# EAGLE design EL00117 (EAGLE 7.6.0)

## Sheet 1 of 3
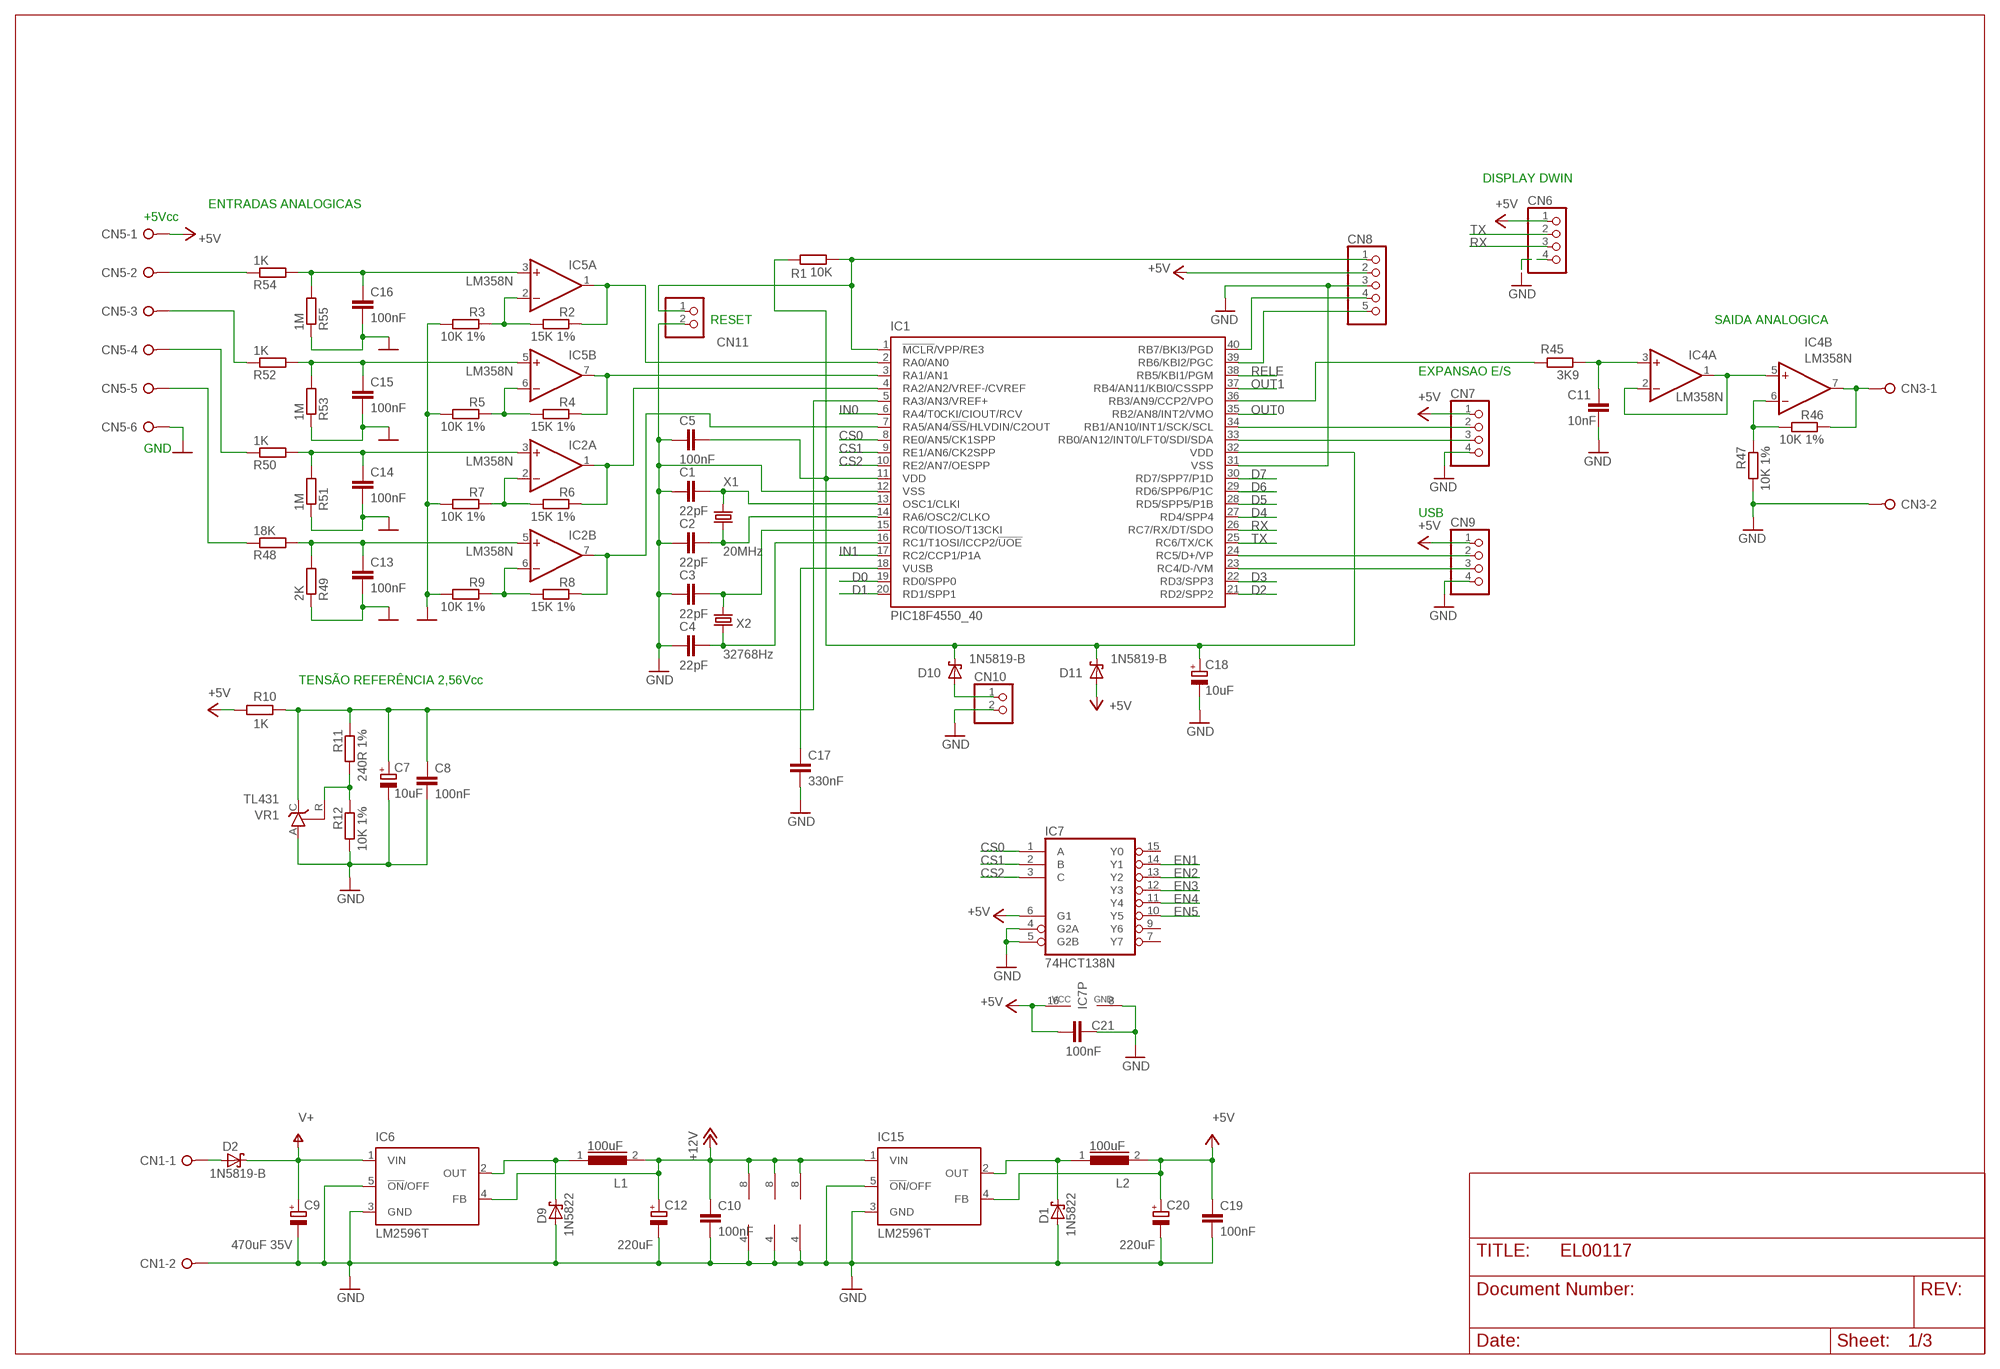
[diagram p0: schematic, sheet 1]

### Parts
C1  22pF  C-EU050-024X044  [C050-024X044]
C2  22pF  C-EU050-024X044  [C050-024X044]
C3  22pF  C-EU050-024X044  [C050-024X044]
C4  22pF  C-EU050-024X044  [C050-024X044]
C5  100nF  C-EU050-024X044  [C050-024X044]
C7  10uF  CPOL-EUE2.5-6  [E2,5-6]
C8  100nF  C-EU050-024X044  [C050-024X044]
C9  470uF 35V  CPOL-EUE3.5-10  [E3,5-10]
C10  100nF  C-EU050-024X044  [C050-024X044]
C11  10nF  C-EU050-024X044  [C050-024X044]
C12  220uF  CPOL-EUE2.5-5  [E2,5-5]
C13  100nF  C-EU050-024X044  [C050-024X044]
C14  100nF  C-EU050-024X044  [C050-024X044]
C15  100nF  C-EU050-024X044  [C050-024X044]
C16  100nF  C-EU050-024X044  [C050-024X044]
C17  330nF  C-EU050-024X044  [C050-024X044]
C18  10uF  CPOL-EUE2.5-6  [E2,5-6]
C19  100nF  C-EU050-024X044  [C050-024X044]
C20  220uF  CPOL-EUE2.5-5  [E2,5-5]
C21  100nF  C-EU050-024X044  [C050-024X044]
CN1  W237-02P  [W237-132]
CN3  W237-02P  [W237-132]
CN5  W237-06P  [W237-6P]
CN6  PINHD-1X4  [1X04]
CN7  PINHD-1X4  [1X04]
CN8  PINHD-1X5  [1X05]
CN9  PINHD-1X4  [1X04]
CN10  PINHD-1X2  [1X02]
CN11  PINHD-1X2  [1X02]
D1  1N5822  1N5819-B  [DO41-7.6]
D2  1N5819-B  [DO41-7.6]
D9  1N5822  1N5819-B  [DO41-7.6]
D10  1N5819-B  [DO41-7.6]
D11  1N5819-B  [DO41-7.6]
IC1  PIC18F4550_40  [DIL40]
IC2  LM358N  [DIL08]
IC4  LM358N  [DIL08]
IC5  LM358N  [DIL08]
IC6  LM2596T  [T05D]
IC7  74HCT138N  [DIL16]
IC15  LM2596T  [T05D]
L1  100uF  82114R  [82114R]
L2  100uF  82114R  [82114R]
R1  10K  R-EU_0309/V  [0309V]
R2  15K 1%  R-EU_0309/V  [0309V]
R3  10K 1%  R-EU_0309/V  [0309V]
R4  15K 1%  R-EU_0309/V  [0309V]
R5  10K 1%  R-EU_0309/V  [0309V]
R6  15K 1%  R-EU_0309/V  [0309V]
R7  10K 1%  R-EU_0309/V  [0309V]
R8  15K 1%  R-EU_0309/V  [0309V]
R9  10K 1%  R-EU_0309/V  [0309V]
R10  1K  R-EU_0309/V  [0309V]
R11  240R 1%  R-EU_0309/V  [0309V]
R12  10K 1%  R-EU_0309/V  [0309V]
R45  3K9  R-EU_0309/V  [0309V]
R46  10K 1%  R-EU_0309/V  [0309V]
R47  10K 1%  R-EU_0309/V  [0309V]
R48  18K  R-EU_0309/V  [0309V]
R49  2K  R-EU_0309/V  [0309V]
R50  1K  R-EU_0309/V  [0309V]
R51  1M  R-EU_0309/V  [0309V]
R52  1K  R-EU_0309/V  [0309V]
R53  1M  R-EU_0309/V  [0309V]
R54  1K  R-EU_0309/V  [0309V]
R55  1M  R-EU_0309/V  [0309V]
VR1  TL431  TL431CLP  [TO92-CLP]
X1  20MHz  CRYSTALHC49U-V  [HC49U-V]
X2  32768Hz  CRYSTALTC26V  [TC26V]

### Nets
+5V: C19.2 C20.+ C21.2 CN5.1 CN6.1 CN7.1 CN8.2 CN9.1 D11.A IC7.6(G1) IC7.16(VCC) IC15.4(FB) L2.2 R10.2 ; also sheet 2,3
+12V: C10.2 C12.+ IC2.8(P:V+) IC4.8(P:V+) IC5.8(P:V+) IC6.4(FB) IC15.1(VIN) L1.2 ; also sheet 2,3
CS0: IC1.8(RE0/AN5/CK1SPP) IC7.1(A)
CS1: IC1.9(RE1/AN6/CK2SPP) IC7.2(B)
CS2: IC1.10(RE2/AN7/OESPP) IC7.3(C)
D0: IC1.19(RD0/SPP0) ; also sheet 2,3
D1: IC1.20(RD1/SPP1) ; also sheet 2,3
D2: IC1.21(RD2/SPP2) ; also sheet 2,3
D3: IC1.22(RD3/SPP3) ; also sheet 2,3
D4: IC1.27(RD4/SPP4) ; also sheet 2,3
D5: IC1.28(RD5/SPP5/P1B) ; also sheet 2,3
D6: IC1.29(RD6/SPP6/P1C) ; also sheet 2,3
D7: IC1.30(RD7/SPP7/P1D) ; also sheet 2,3
EN1: IC7.14(Y1) ; also sheet 2
EN2: IC7.13(Y2) ; also sheet 2
EN3: IC7.12(Y3) ; also sheet 3
EN4: IC7.11(Y4) ; also sheet 3
EN5: IC7.10(Y5) ; also sheet 3
GND: C1.1 C2.1 C3.1 C4.1 C5.1 C7.- C8.1 C9.- C10.1 C11.1 C12.- C13.1 C14.1 C15.1 C16.1 C17.1 C18.- C19.1 C20.- C21.1 CN1.2 CN3.2 CN5.6 CN6.4 CN7.4 CN8.3 CN9.4 CN10.2 CN11.2 D1.A D9.A IC1.12(VSS) IC1.31(VSS) IC2.4(P:V-) IC4.4(P:V-) IC5.4(P:V-) IC6.3(GND) IC6.5(!ON!/OFF) IC7.4(G2A) IC7.5(G2B) IC7.8(GND) IC15.3(GND) IC15.5(!ON!/OFF) R3.2 R5.2 R7.2 R9.2 R12.2 R47.2 R49.1 R51.1 R53.1 R55.1 VR1.A ; also sheet 2,3
IN0: IC1.6(RA4/T0CKI/CIOUT/RCV) ; also sheet 2
IN1: IC1.17(RC2/CCP1/P1A) ; also sheet 2
N$1: C1.2 IC1.13(OSC1/CLKI) X1.2
N$2: C2.2 IC1.14(RA6/OSC2/CLKO) X1.1
N$4: C3.2 IC1.15(RC0/TIOSO/T13CKI) X2.2
N$5: C4.2 IC1.16(RC1/T1OSI/ICCP2/!UOE) X2.1
N$7: CN8.1 CN11.1 IC1.1(!MCLR!/VPP/RE3) R1.1
N$8: IC5.2(A:-IN) R2.2 R3.1
N$9: IC1.2(RA0/AN0) IC5.1(A:OUT) R2.1
N$10: IC1.3(RA1/AN1) IC5.7(B:OUT) R4.1
N$11: IC5.6(B:-IN) R4.2 R5.1
N$12: CN5.2 R54.1
N$13: IC2.2(A:-IN) R6.2 R7.1
N$14: IC2.6(B:-IN) R8.2 R9.1
N$15: IC1.7(RA5/AN4/!SS!/HLVDIN/C2OUT) IC2.7(B:OUT) R8.1
N$16: CN5.3 R52.1
N$17: CN5.4 R50.1
N$18: CN5.5 R48.1
N$21: C7.+ C8.2 IC1.5(RA3/AN3/VREF+) R10.1 R11.1 VR1.C
N$22: R11.2 R12.1 VR1.R
N$23: IC1.4(RA2/AN2/VREF-/CVREF) IC2.1(A:OUT) R6.1
N$25: CN1.1 D2.A
N$28: C13.2 IC2.5(B:+IN) R48.2 R49.2
N$29: C15.2 IC5.5(B:+IN) R52.2 R53.2
N$66: CN7.2 IC1.34(RB1/AN10/INT1/SCK/SCL)
N$68: CN7.3 IC1.33(RB0/AN12/INT0/LFT0/SDI/SDA)
N$69: IC4.1(A:OUT) IC4.2(A:-IN) IC4.5(B:+IN)
N$71: C11.2 IC4.3(A:+IN) R45.1
N$72: IC1.36(RB3/AN9/CCP2/VPO) R45.2
N$73: IC4.6(B:-IN) R46.2 R47.1
N$74: CN3.1 IC4.7(B:OUT) R46.1
N$75: CN9.2 IC1.24(RC5/D+/VP)
N$77: CN9.3 IC1.23(RC4/D-/VM)
N$79: C5.2 C18.+ D10.C D11.C IC1.11(VDD) IC1.32(VDD) R1.2
N$80: C17.2 IC1.18(VUSB)
N$84: CN8.4 IC1.40(RB7/BKI3/PGD)
N$86: CN8.5 IC1.39(RB6/KBI2/PGC)
N$89: CN10.1 D10.A
N$90: D9.C IC6.2(OUT) L1.1
N$137: C16.2 IC5.3(A:+IN) R54.2 R55.2
N$138: C14.2 IC2.3(A:+IN) R50.2 R51.2
N$153: D1.C IC15.2(OUT) L2.1
OUT0: IC1.35(RB2/AN8/INT2/VMO) ; also sheet 2
OUT1: IC1.37(RB4/AN11/KBI0/CSSPP) ; also sheet 2
RELE: IC1.38(RB5/KBI1/PGM) ; also sheet 3
RX: CN6.3 IC1.26(RC7/RX/DT/SDO)
TX: CN6.2 IC1.25(RC6/TX/CK)
V+: C9.+ D2.C IC6.1(VIN)
Unconnected: IC7.7(Y7) IC7.9(Y6) IC7.15(Y0)

### Notes on the sheet
- DISPLAY DWIN
- ENTRADAS ANALOGICAS
- +5Vcc
- RESET | SAIDA ANALOGICA
- EXPANSAO E/S
- GND
- USB
- TENSÃO REFERÊNCIA 2,56Vcc

## Sheet 2 of 3
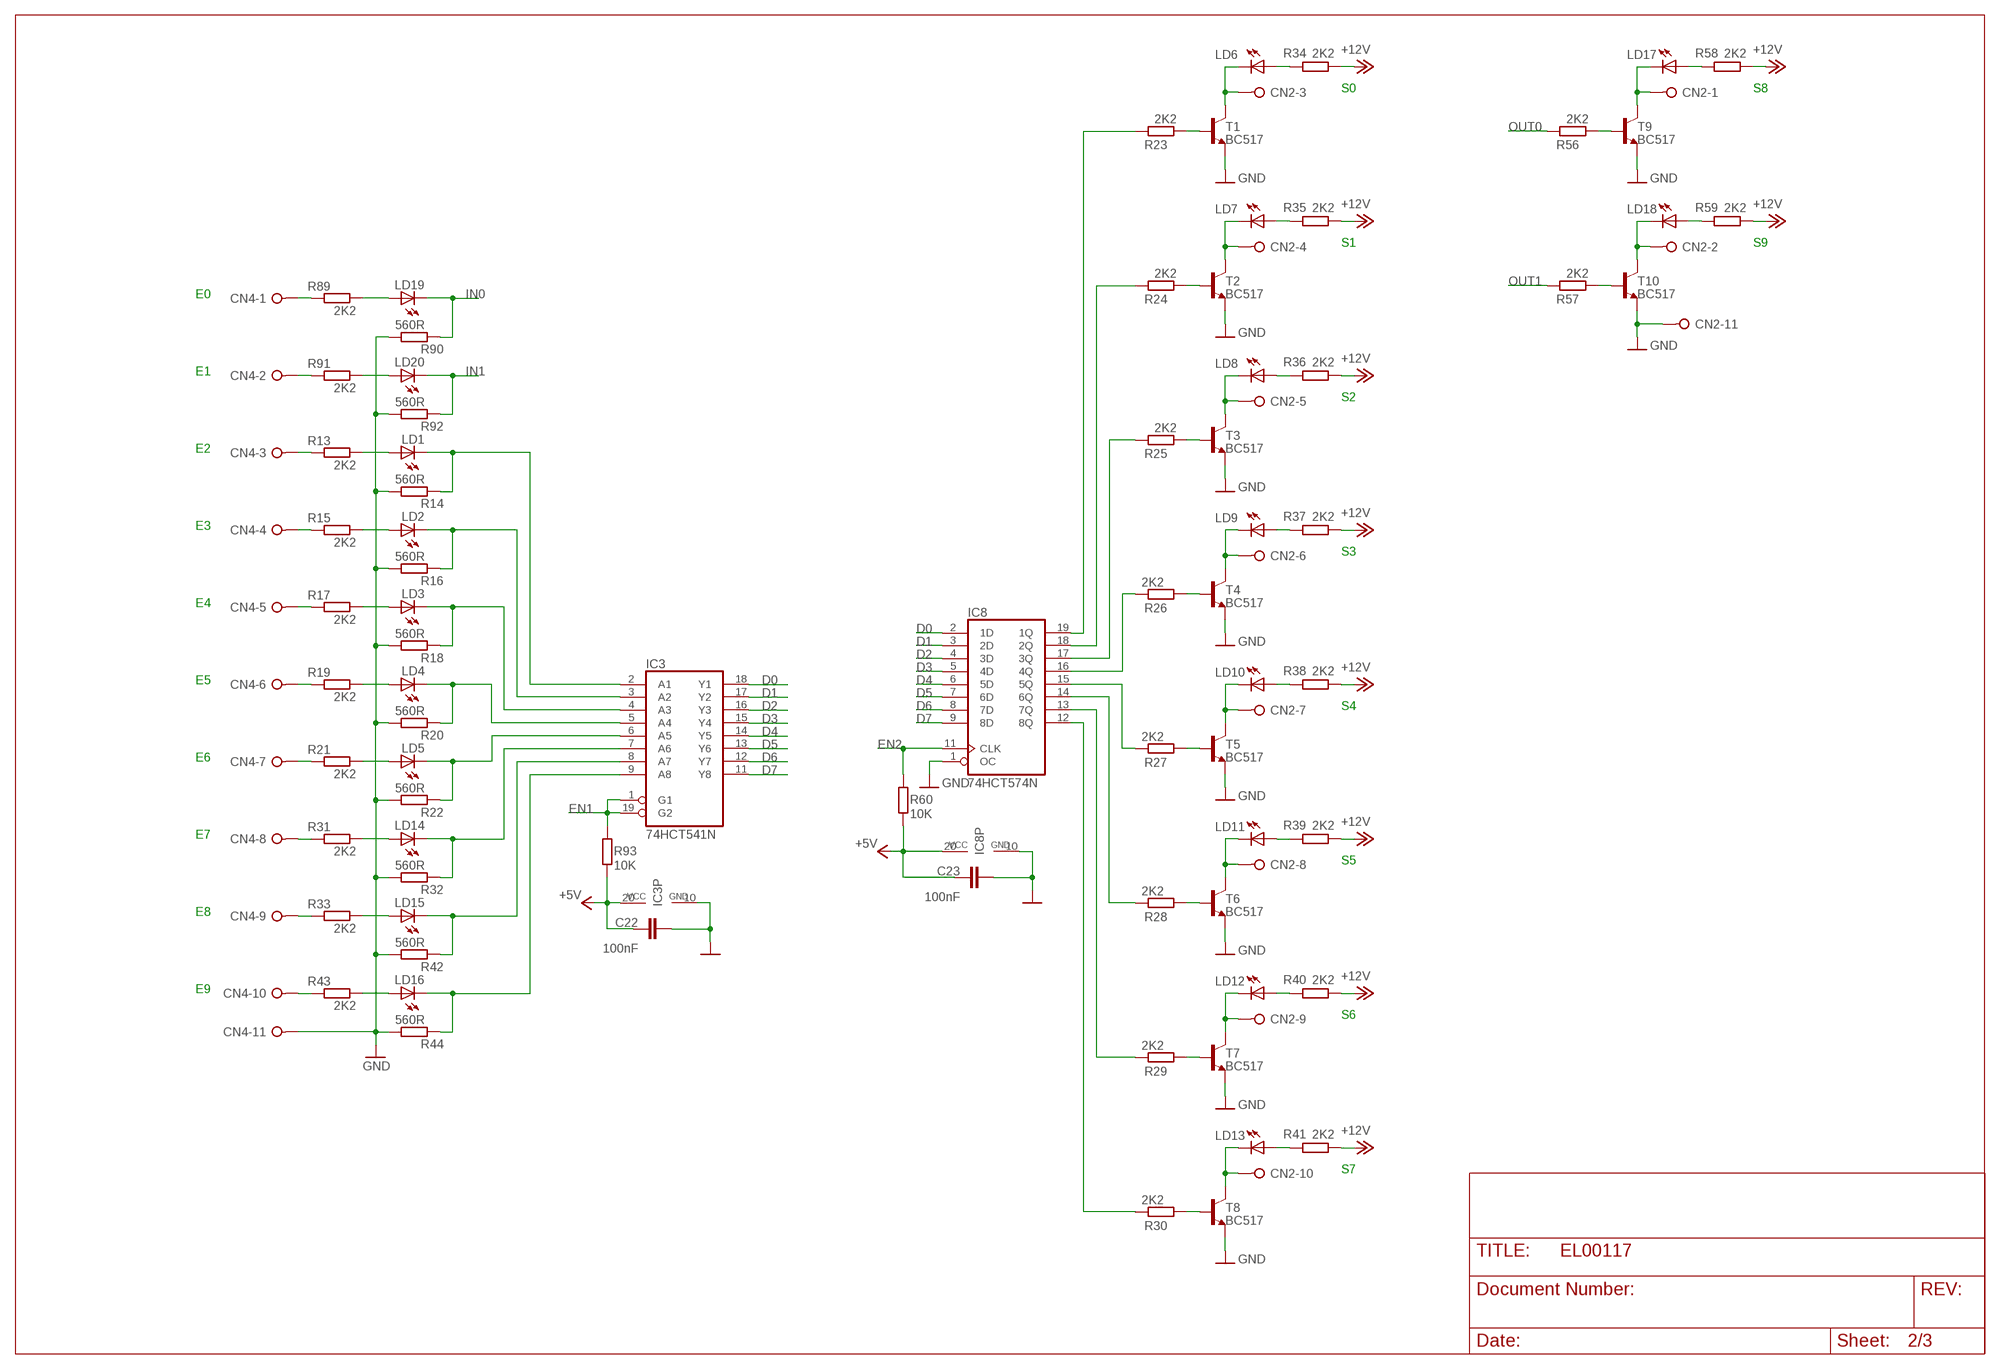
[diagram p1: schematic, sheet 2]

### Parts
C22  100nF  C-EU050-024X044  [C050-024X044]
C23  100nF  C-EU050-024X044  [C050-024X044]
CN2  W237-11P  [W237-11P]
CN4  W237-11P  [W237-11P]
IC3  74HCT541N  [DIL20]
IC8  74HCT574N  [DIL20]
LD1  LED3MM  [LED3MM]
LD2  LED3MM  [LED3MM]
LD3  LED3MM  [LED3MM]
LD4  LED3MM  [LED3MM]
LD5  LED3MM  [LED3MM]
LD6  LED3MM  [LED3MM]
LD7  LED3MM  [LED3MM]
LD8  LED3MM  [LED3MM]
LD9  LED3MM  [LED3MM]
LD10  LED3MM  [LED3MM]
LD11  LED3MM  [LED3MM]
LD12  LED3MM  [LED3MM]
LD13  LED3MM  [LED3MM]
LD14  LED3MM  [LED3MM]
LD15  LED3MM  [LED3MM]
LD16  LED3MM  [LED3MM]
LD17  LED3MM  [LED3MM]
LD18  LED3MM  [LED3MM]
LD19  LED3MM  [LED3MM]
LD20  LED3MM  [LED3MM]
R13  2K2  R-EU_0309/V  [0309V]
R14  560R  R-EU_0309/V  [0309V]
R15  2K2  R-EU_0309/V  [0309V]
R16  560R  R-EU_0309/V  [0309V]
R17  2K2  R-EU_0309/V  [0309V]
R18  560R  R-EU_0309/V  [0309V]
R19  2K2  R-EU_0309/V  [0309V]
R20  560R  R-EU_0309/V  [0309V]
R21  2K2  R-EU_0309/V  [0309V]
R22  560R  R-EU_0309/V  [0309V]
R23  2K2  R-EU_0309/V  [0309V]
R24  2K2  R-EU_0309/V  [0309V]
R25  2K2  R-EU_0309/V  [0309V]
R26  2K2  R-EU_0309/V  [0309V]
R27  2K2  R-EU_0309/V  [0309V]
R28  2K2  R-EU_0309/V  [0309V]
R29  2K2  R-EU_0309/V  [0309V]
R30  2K2  R-EU_0309/V  [0309V]
R31  2K2  R-EU_0309/V  [0309V]
R32  560R  R-EU_0309/V  [0309V]
R33  2K2  R-EU_0309/V  [0309V]
R34  2K2  R-EU_0309/V  [0309V]
R35  2K2  R-EU_0309/V  [0309V]
R36  2K2  R-EU_0309/V  [0309V]
R37  2K2  R-EU_0309/V  [0309V]
R38  2K2  R-EU_0309/V  [0309V]
R39  2K2  R-EU_0309/V  [0309V]
R40  2K2  R-EU_0309/V  [0309V]
R41  2K2  R-EU_0309/V  [0309V]
R42  560R  R-EU_0309/V  [0309V]
R43  2K2  R-EU_0309/V  [0309V]
R44  560R  R-EU_0309/V  [0309V]
R56  2K2  R-EU_0309/V  [0309V]
R57  2K2  R-EU_0309/V  [0309V]
R58  2K2  R-EU_0309/V  [0309V]
R59  2K2  R-EU_0309/V  [0309V]
R60  10K  R-EU_0309/V  [0309V]
R89  2K2  R-EU_0309/V  [0309V]
R90  560R  R-EU_0309/V  [0309V]
R91  2K2  R-EU_0309/V  [0309V]
R92  560R  R-EU_0309/V  [0309V]
R93  10K  R-EU_0309/V  [0309V]
T1  BC517  BC517-NPN-TO92-CBE  [TO92-CBE]
T2  BC517  BC517-NPN-TO92-CBE  [TO92-CBE]
T3  BC517  BC517-NPN-TO92-CBE  [TO92-CBE]
T4  BC517  BC517-NPN-TO92-CBE  [TO92-CBE]
T5  BC517  BC517-NPN-TO92-CBE  [TO92-CBE]
T6  BC517  BC517-NPN-TO92-CBE  [TO92-CBE]
T7  BC517  BC517-NPN-TO92-CBE  [TO92-CBE]
T8  BC517  BC517-NPN-TO92-CBE  [TO92-CBE]
T9  BC517  BC517-NPN-TO92-CBE  [TO92-CBE]
T10  BC517  BC517-NPN-TO92-CBE  [TO92-CBE]

### Nets
+5V: C22.1 C23.1 IC3.20(VCC) IC8.20(VCC) R60.2 R93.2 ; also sheet 1,3
+12V: R34.1 R35.1 R36.1 R37.1 R38.1 R39.1 R40.1 R41.1 R58.1 R59.1 ; also sheet 1,3
D0: IC3.18(Y1) IC8.2(1D) ; also sheet 1,3
D1: IC3.17(Y2) IC8.3(2D) ; also sheet 1,3
D2: IC3.16(Y3) IC8.4(3D) ; also sheet 1,3
D3: IC3.15(Y4) IC8.5(4D) ; also sheet 1,3
D4: IC3.14(Y5) IC8.6(5D) ; also sheet 1,3
D5: IC3.13(Y6) IC8.7(6D) ; also sheet 1,3
D6: IC3.12(Y7) IC8.8(7D) ; also sheet 1,3
D7: IC3.11(Y8) IC8.9(8D) ; also sheet 1,3
ED0: IC3.2(A1) LD1.K(C) R14.2
ED1: IC3.3(A2) LD2.K(C) R16.2
ED2: IC3.4(A3) LD3.K(C) R18.2
ED3: IC3.5(A4) LD4.K(C) R20.2
ED4: IC3.6(A5) LD5.K(C) R22.2
ED5: IC3.7(A6) LD14.K(C) R32.2
ED6: IC3.8(A7) LD15.K(C) R42.2
ED7: IC3.9(A8) LD16.K(C) R44.2
EN1: IC3.1(G1) IC3.19(G2) R93.1 ; also sheet 1
EN2: IC8.11(CLK) R60.1 ; also sheet 1
GND: C22.2 C23.2 CN2.11 CN4.11 IC3.10(GND) IC8.1(OC) IC8.10(GND) R14.1 R16.1 R18.1 R20.1 R22.1 R32.1 R42.1 R44.1 R90.1 R92.1 T1.E T2.E T3.E T4.E T5.E T6.E T7.E T8.E T9.E T10.E ; also sheet 1,3
IN0: LD19.K(C) R90.2 ; also sheet 1
IN1: LD20.K(C) R92.2 ; also sheet 1
N$3: R56.2 T9.B
N$6: R57.2 T10.B
N$20: R29.2 T7.B
N$24: LD1.A R13.1
N$27: R30.2 T8.B
N$30: CN2.1 LD17.K(C) T9.C
N$31: LD2.A R15.1
N$32: R23.2 T1.B
N$33: LD3.A R17.1
N$34: R24.2 T2.B
N$35: LD4.A R19.1
N$36: LD5.A R21.1
N$37: R25.2 T3.B
N$38: CN4.1 R89.2
N$39: R26.2 T4.B
N$40: R27.2 T5.B
N$41: R28.2 T6.B
N$42: CN4.2 R91.2
N$43: CN4.3 R13.2
N$44: CN4.4 R15.2
N$45: CN4.5 R17.2
N$46: CN2.3 LD6.K(C) T1.C
N$47: CN2.4 LD7.K(C) T2.C
N$48: LD6.A R34.2
N$49: LD7.A R35.2
N$50: CN2.5 LD8.K(C) T3.C
N$51: LD8.A R36.2
N$52: CN2.6 LD9.K(C) T4.C
N$53: LD9.A R37.2
N$54: CN2.7 LD10.K(C) T5.C
N$55: CN2.8 LD11.K(C) T6.C
N$56: LD10.A R38.2
N$57: LD11.A R39.2
N$58: CN2.9 LD12.K(C) T7.C
N$59: LD12.A R40.2
N$60: CN2.10 LD13.K(C) T8.C
N$61: LD13.A R41.2
N$62: CN2.2 LD18.K(C) T10.C
N$64: LD17.A R58.2
N$65: LD18.A R59.2
N$67: LD14.A R31.1
N$70: CN4.6 R19.2
N$76: CN4.7 R21.2
N$78: CN4.8 R31.2
N$81: LD15.A R33.1
N$82: CN4.9 R33.2
N$83: CN4.10 R43.2
N$85: LD16.A R43.1
N$97: IC8.16(4Q) R26.1
N$98: IC8.15(5Q) R27.1
N$99: IC8.17(3Q) R25.1
N$100: IC8.18(2Q) R24.1
N$101: IC8.19(1Q) R23.1
N$102: IC8.14(6Q) R28.1
N$103: IC8.13(7Q) R29.1
N$104: IC8.12(8Q) R30.1
N$183: LD19.A R89.1
N$184: LD20.A R91.1
OUT0: R56.1 ; also sheet 1
OUT1: R57.1 ; also sheet 1

### Notes on the sheet
- S0 | S8
- S1 | S9
- E0
- E1
- S2
- E2
- E3
- S3
- E4
- E5
- S4
- E6
- E7
- S5
- E8
- E9
- S6
- S7

## Sheet 3 of 3
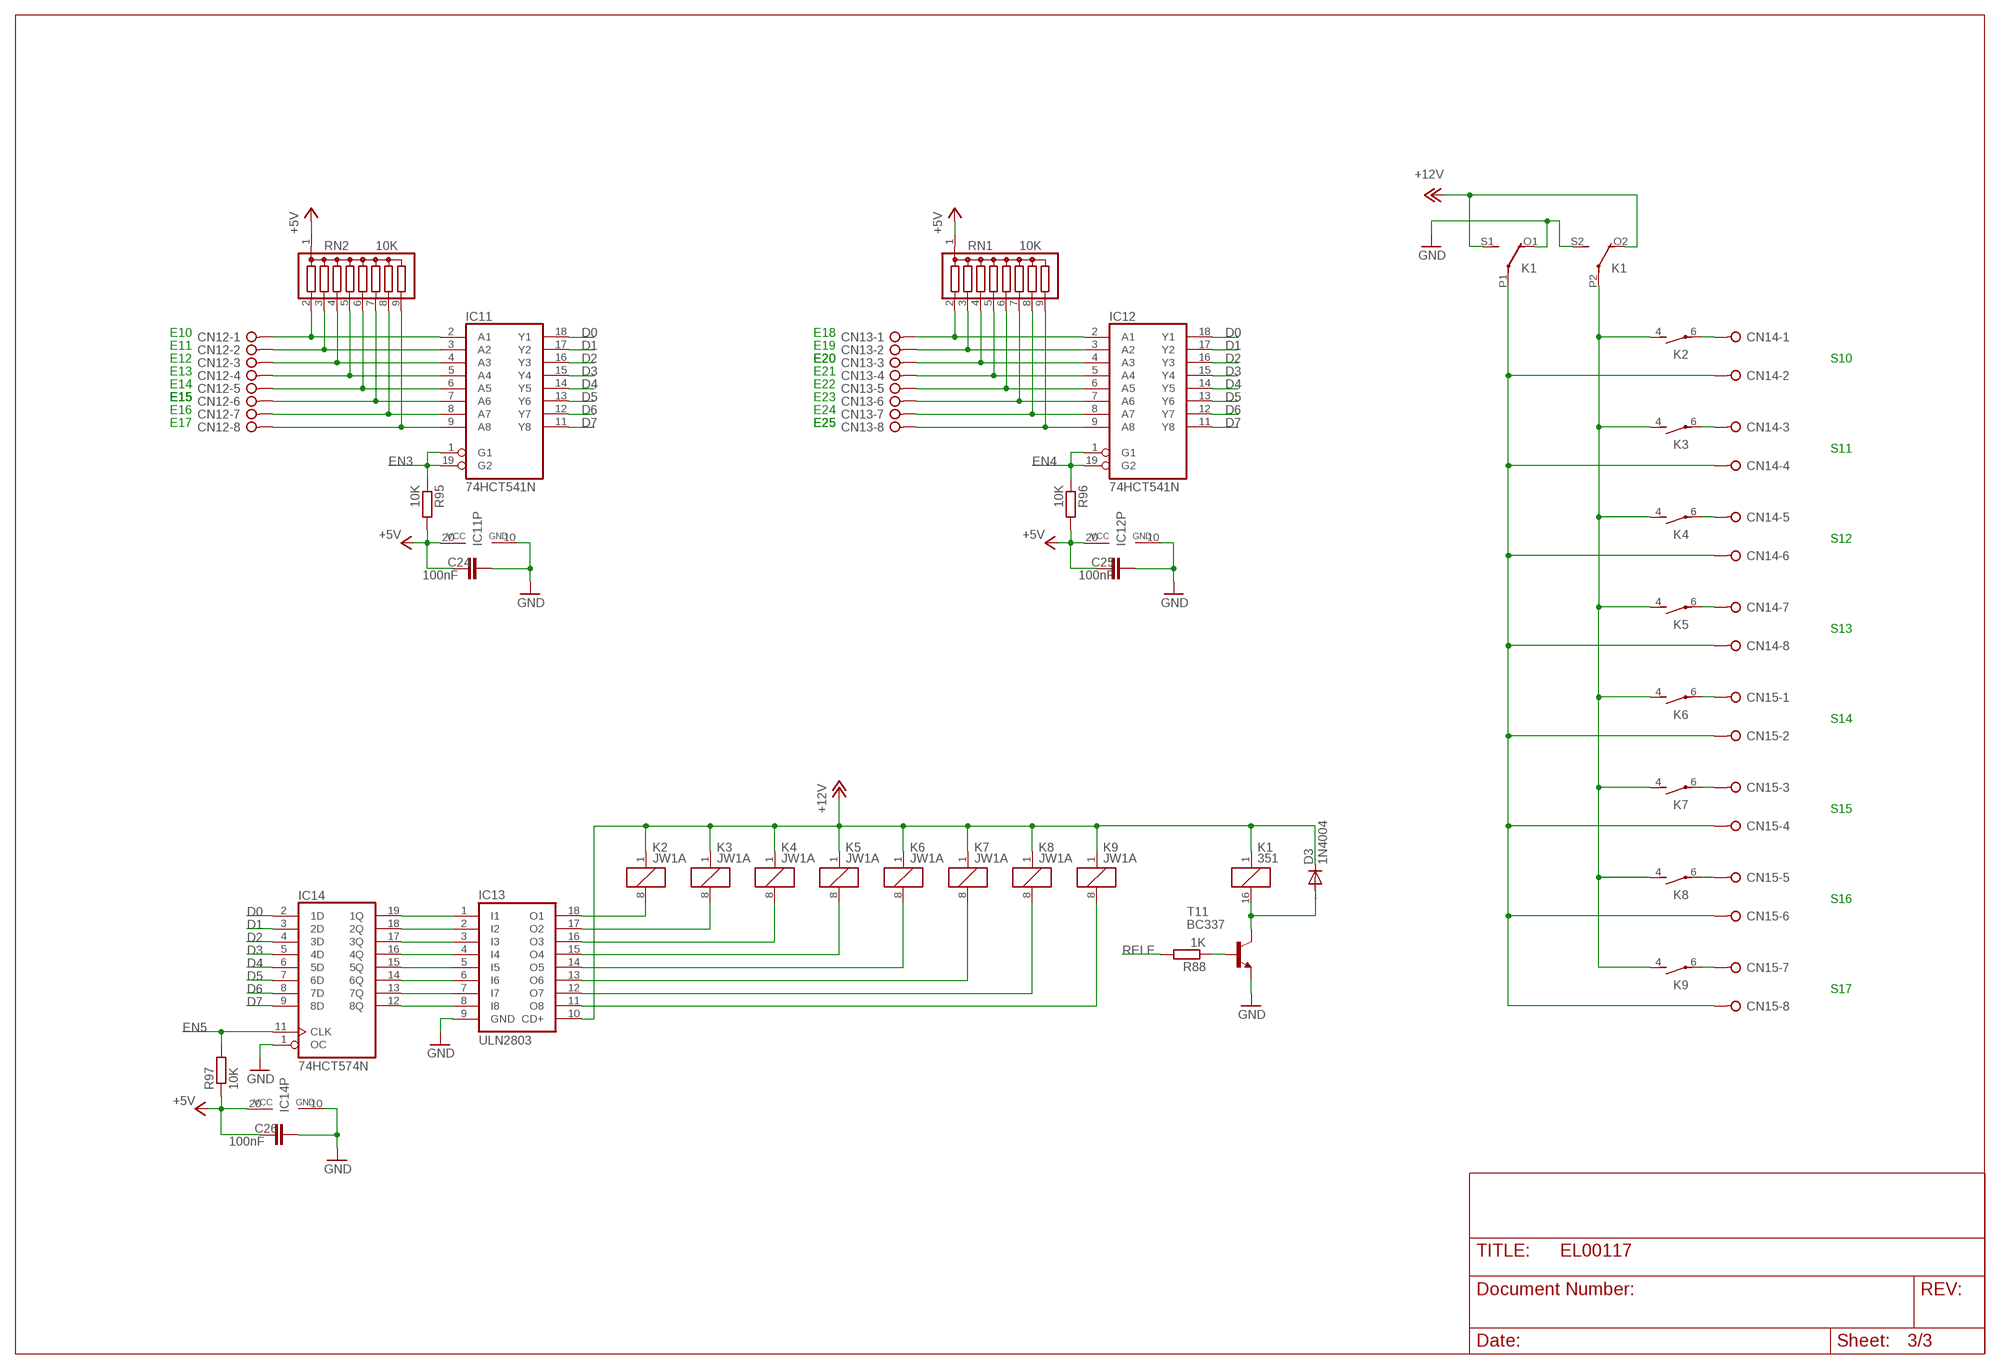
[diagram p2: schematic, sheet 3]

### Parts
C24  100nF  C-EU050-024X044  [C050-024X044]
C25  100nF  C-EU050-024X044  [C050-024X044]
C26  100nF  C-EU050-024X044  [C050-024X044]
CN12  W237-08P  [W237-8P]
CN13  W237-08P  [W237-8P]
CN14  W237-08P  [W237-8P]
CN15  W237-08P  [W237-8P]
D3  1N4004  [DO41-10]
IC11  74HCT541N  [DIL20]
IC12  74HCT541N  [DIL20]
IC13  ULN2803  ULN2803A  [DIL18]
IC14  74HCT574N  [DIL20]
K1  351  [351]
K2  JW1A  [JW1A]
K3  JW1A  [JW1A]
K4  JW1A  [JW1A]
K5  JW1A  [JW1A]
K6  JW1A  [JW1A]
K7  JW1A  [JW1A]
K8  JW1A  [JW1A]
K9  JW1A  [JW1A]
R88  1K  R-EU_0309/V  [0309V]
R95  10K  R-EU_0309/V  [0309V]
R96  10K  R-EU_0309/V  [0309V]
R97  10K  R-EU_0309/V  [0309V]
RN1  10K  G08R  [SIL9]
RN2  10K  G08R  [SIL9]
T11  BC337  [TO92]

### Nets
+5V: C24.1 C25.2 C26.2 IC11.20(VCC) IC12.20(VCC) IC14.20(VCC) R95.2 R96.2 R97.1 RN1.1 RN2.1 ; also sheet 1,2
+12V: D3.C IC13.10(CD+) K1.1 K1.O2(3:O) K1.S1(2:S) K2.1 K3.1 K4.1 K5.1 K6.1 K7.1 K8.1 K9.1 ; also sheet 1,2
D0: IC11.18(Y1) IC12.18(Y1) IC14.2(1D) ; also sheet 1,2
D1: IC11.17(Y2) IC12.17(Y2) IC14.3(2D) ; also sheet 1,2
D2: IC11.16(Y3) IC12.16(Y3) IC14.4(3D) ; also sheet 1,2
D3: IC11.15(Y4) IC12.15(Y4) IC14.5(4D) ; also sheet 1,2
D4: IC11.14(Y5) IC12.14(Y5) IC14.6(5D) ; also sheet 1,2
D5: IC11.13(Y6) IC12.13(Y6) IC14.7(6D) ; also sheet 1,2
D6: IC11.12(Y7) IC12.12(Y7) IC14.8(7D) ; also sheet 1,2
D7: IC11.11(Y8) IC12.11(Y8) IC14.9(8D) ; also sheet 1,2
EN3: IC11.1(G1) IC11.19(G2) R95.1 ; also sheet 1
EN4: IC12.1(G1) IC12.19(G2) R96.1 ; also sheet 1
EN5: IC14.11(CLK) R97.2 ; also sheet 1
GND: C24.2 C25.1 C26.1 IC11.10(GND) IC12.10(GND) IC13.9(GND) IC14.1(OC) IC14.10(GND) K1.O1(2:O) K1.S2(3:S) T11.1(E) ; also sheet 1,2
N$19: CN12.1 IC11.2(A1) RN2.2
N$26: IC13.18(O1) K2.8
N$63: CN12.2 IC11.3(A2) RN2.3
N$139: CN12.3 IC11.4(A3) RN2.4
N$140: CN12.4 IC11.5(A4) RN2.5
N$141: CN12.5 IC11.6(A5) RN2.6
N$142: CN12.6 IC11.7(A6) RN2.7
N$143: CN12.7 IC11.8(A7) RN2.8
N$144: CN12.8 IC11.9(A8) RN2.9
N$145: CN13.1 IC12.2(A1) RN1.2
N$146: CN13.2 IC12.3(A2) RN1.3
N$147: CN13.3 IC12.4(A3) RN1.4
N$148: CN13.4 IC12.5(A4) RN1.5
N$149: CN13.5 IC12.6(A5) RN1.6
N$150: CN13.6 IC12.7(A6) RN1.7
N$151: CN13.7 IC12.8(A7) RN1.8
N$152: CN13.8 IC12.9(A8) RN1.9
N$155: K1.P2(3:P) K2.4(1:S) K3.4(1:S) K4.4(1:S) K5.4(1:S) K6.4(1:S) K7.4(1:S) K8.4(1:S) K9.4(1:S)
N$156: IC13.17(O2) K3.8
N$157: CN14.1 K2.6(1:P)
N$158: CN14.3 K3.6(1:P)
N$159: CN14.5 K4.6(1:P)
N$160: CN14.7 K5.6(1:P)
N$161: CN15.1 K6.6(1:P)
N$162: CN15.3 K7.6(1:P)
N$163: CN15.5 K8.6(1:P)
N$164: CN15.7 K9.6(1:P)
N$165: IC13.16(O3) K4.8
N$166: IC13.15(O4) K5.8
N$167: IC13.14(O5) K6.8
N$168: IC13.13(O6) K7.8
N$169: IC13.12(O7) K8.8
N$170: IC13.11(O8) K9.8
N$171: R88.1 T11.2(B)
N$172: IC13.1(I1) IC14.19(1Q)
N$173: CN14.2 CN14.4 CN14.6 CN14.8 CN15.2 CN15.4 CN15.6 CN15.8 K1.P1(2:P)
N$174: IC13.2(I2) IC14.18(2Q)
N$175: IC13.3(I3) IC14.17(3Q)
N$176: IC13.4(I4) IC14.16(4Q)
N$177: IC13.5(I5) IC14.15(5Q)
N$178: IC13.6(I6) IC14.14(6Q)
N$179: IC13.7(I7) IC14.13(7Q)
N$180: IC13.8(I8) IC14.12(8Q)
N$181: D3.A K1.16 T11.3(C)
RELE: R88.2 ; also sheet 1

### Notes on the sheet
- E10 | E18
- E11 | E19
- E12 | E20 | E20 | S10
- E13 | E21
- E14 | E22
- E15 | E15 | E15 | E23
- E16 | E24
- E17 | E25 | E25
- S11
- S12
- S13
- S14
- S15
- S16
- S17

## Library data of the parts
C1-C5 C8 C10 C11 C13-C17 C19 C21-C26 = rcl:C-EU: CAPACITOR, European symbol
C7 C9 C12 C18 C20 = rcl:CPOL-EU: POLARIZED CAPACITOR, European symbol
CN1 CN3 = con-wago-508:W237-02P: WAGO SREW CLAMP; OC_FARNELL: unknown; OC_NEWARK: unknown
CN2 CN4 = con-wago-508:W237-11P: WAGO SREW CLAMP; OC_FARNELL: unknown; OC_NEWARK: unknown
CN5 = con-wago-508:W237-06P: WAGO SREW CLAMP; OC_FARNELL: unknown; OC_NEWARK: unknown
CN6 CN7 CN9 = pinhead:PINHD-1X4: PIN HEADER
CN8 = pinhead:PINHD-1X5: PIN HEADER
CN10 CN11 = pinhead:PINHD-1X2: PIN HEADER
CN12-CN15 = con-wago-508:W237-08P: WAGO SREW CLAMP; OC_FARNELL: unknown; OC_NEWARK: unknown
D1 D2 D9-D11 = diode:1N581*: 1.0A SCHOTTKY BARRIER RECTIFIER Source: http://www.diodes.com/datasheets/ds23001.pdf
D3 = diode:1N4004: DIODE general purpose rectifier, 1 A
IC1 = microchip:PIC18F4*_40: USB Microcontrollers with nanoWatt Technology High-Performance, Enhanced Flash, 28/40/44-Pin, Source: http://ww1.microchip.com/downloads/en/devicedoc/39632c.pdf; MF: MICROCHIP; MPN: PIC18F4550-I/P; OC_FARNELL: 9321357; OC_NEWARK: 74K8623
IC2 IC4 IC5 = linear:LM358: OP AMP also LM158; LM258; LM2904 Source: http://cache.national.com/ds/LM/LM158.pdf
IC3 IC11 IC12 = 74xx-eu:74*541: Octal BUFFER and LINE DRIVER, 3-state
IC6 IC15 = national-semiconductor:LM2596: SIMPLE SWITCHER® Power Converter 150 kHz 3A Step-Down Voltage Regulator Source: http://www.national.com/ds/LM/LM2596.pdf; MPN: LM2596T-ADJ/LF02; OC_FARNELL: 9494162; OC_NEWARK: 65K5910
IC7 = 74xx-eu:74*138: 3-line to 8-line DECODER/DEMULTIPLEXER
IC8 IC14 = 74xx-eu:74*574: 8-bit D type FLIP FLOP bus driver
IC13 = uln-udn:ULN2803A: DRIVER ARRAY
K1 = relay:351: RELAY 2 x switch, Omron; OC_FARNELL: unknown; OC_NEWARK: unknown
K2-K9 = relay:JW1A: Power relay Source: Panasonic Electric Works Co., Ltd. / jw.catalog.pdf
L1 L2 = inductors:82114R: INDUCTOR
LD1-LD20 = led:LED: LED OSRAM: - CHIPLED LG R971, LG N971, LY N971, LG Q971, LY Q971, LO R971, LY R971 LH N974, LH R974 LS Q976, LO Q976, LY Q976 LO Q996 - Hyper CHIPLED LW Q18S LB Q993, LB Q99A, LB R99A - SideLED LS A670, LO A670, LY A670, LG A670, LP A670 LB A673, LV A673, LT A673, LW A673 LH A674 LY A675 LS A676, LA A676, LO A676, LY A676, LW A676 LS A679, LY A679, LG A679 - Hyper Micro SIDELED® LS Y876, LA Y876, LO Y876, LY Y876 LT Y87S - SmartLED LW L88C, LW L88S LB L89C, LB L89S, LG L890 LS L89K, LO L89K, LY L89K LS L896, LA L896, LO L896, LY L896 - TOPLED LS T670, LO T670, LY T670, LG T670, LP T670 LSG T670, LSP T670, LSY T670, LOP T670, LYG T670 LG T671, LOG T671, LSG T671 LB T673, LV T673, LT T673, LW T673 LH T674 LS T676, LA T676, LO T676, LY T676, LB T676, LH T676, LSB T676, LW T676 LB T67C, LV T67C, LT T67C, LS T67K, LO T67K, LY T67K, LW E67C LS E67B, LA E67B, LO E67B, LY E67B, LB E67C, LV E67C, LT E67C LW T67C LS T679, LY T679, LG T679 LS T770, LO T770, LY T770, LG T770, LP T770 LB T773, LV T773, LT T773, LW T773 LH T774 LS E675, LA E675, LY E675, LS T675 LS T776, LA T776, LO T776, LY T776, LB T776 LHGB T686 LT T68C, LB T68C - Hyper Mini TOPLED® LB M676 - Mini TOPLED Santana® LG M470 LS M47K, LO M47K, LY M47K Source: http://www.osram.convergy.de LUXEON: - LUMILED® LXK2-PW12-R00, LXK2-PW12-S00, LXK2-PW14-U00, LXK2-PW14-V00 LXK2-PM12-R00, LXK2-PM12-S00, LXK2-PM14-U00 LXK2-PE12-Q00, LXK2-PE12-R00, LXK2-PE12-S00, LXK2-PE14-T00, LXK2-PE14-U00 LXK2-PB12-K00, LXK2-PB12-L00, LXK2-PB12-M00, LXK2-PB14-N00, LXK2-PB14-P00, LXK2-PB14-Q00 LXK2-PR12-L00, LXK2-PR12-M00, LXK2-PR14-Q00, LXK2-PR14-R00 LXK2-PD12-Q00, LXK2-PD12-R00, LXK2-PD12-S00 LXK2-PH12-R00, LXK2-PH12-S00 LXK2-PL12-P00, LXK2-PL12-Q00, LXK2-PL12-R00 Source: www.luxeon.com KINGBRIGHT: KA-3528ASYC Source: www.kingbright.com
R1-R60 R88-R93 R95-R97 = rcl:R-EU_: RESISTOR, European symbol
RN1 RN2 = resistor-sil:G08R: SIL RESISTOR; OC_FARNELL: unknown; OC_NEWARK: unknown
T1-T10 = transistor:*-NPN-: NPN Transistror BF959 corrected 2008.03.06
T11 = transistor:BC337: NPN TRANSISTOR
VR1 = v-reg:TL431CLP: VOLTAGE REGULATOR
X1 = crystal:CRYSTAL: CRYSTAL; OC_FARNELL: 1666969; OC_NEWARK: unknown
X2 = crystal:CRYSTAL: CRYSTAL; OC_FARNELL: unknown; OC_NEWARK: unknown

## Board
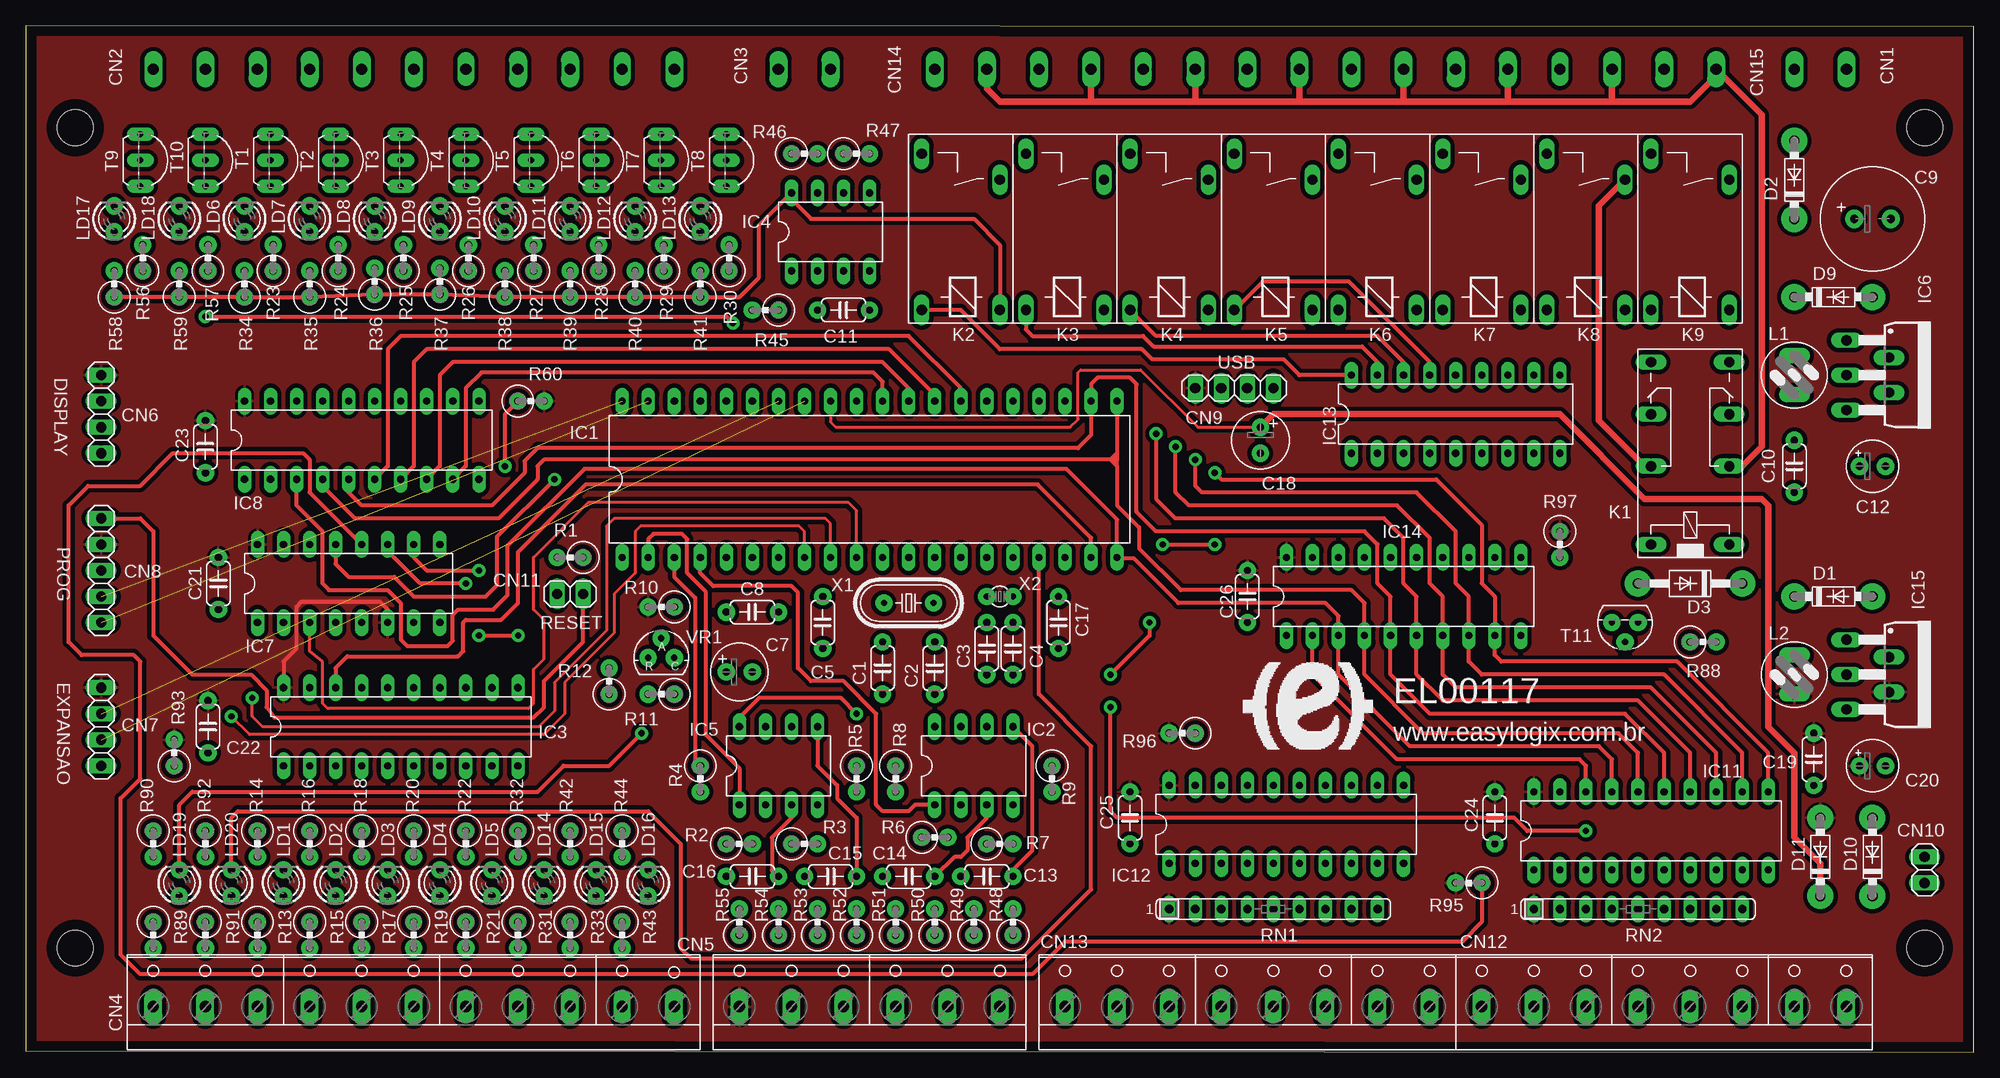
[diagram p3: board, top side]
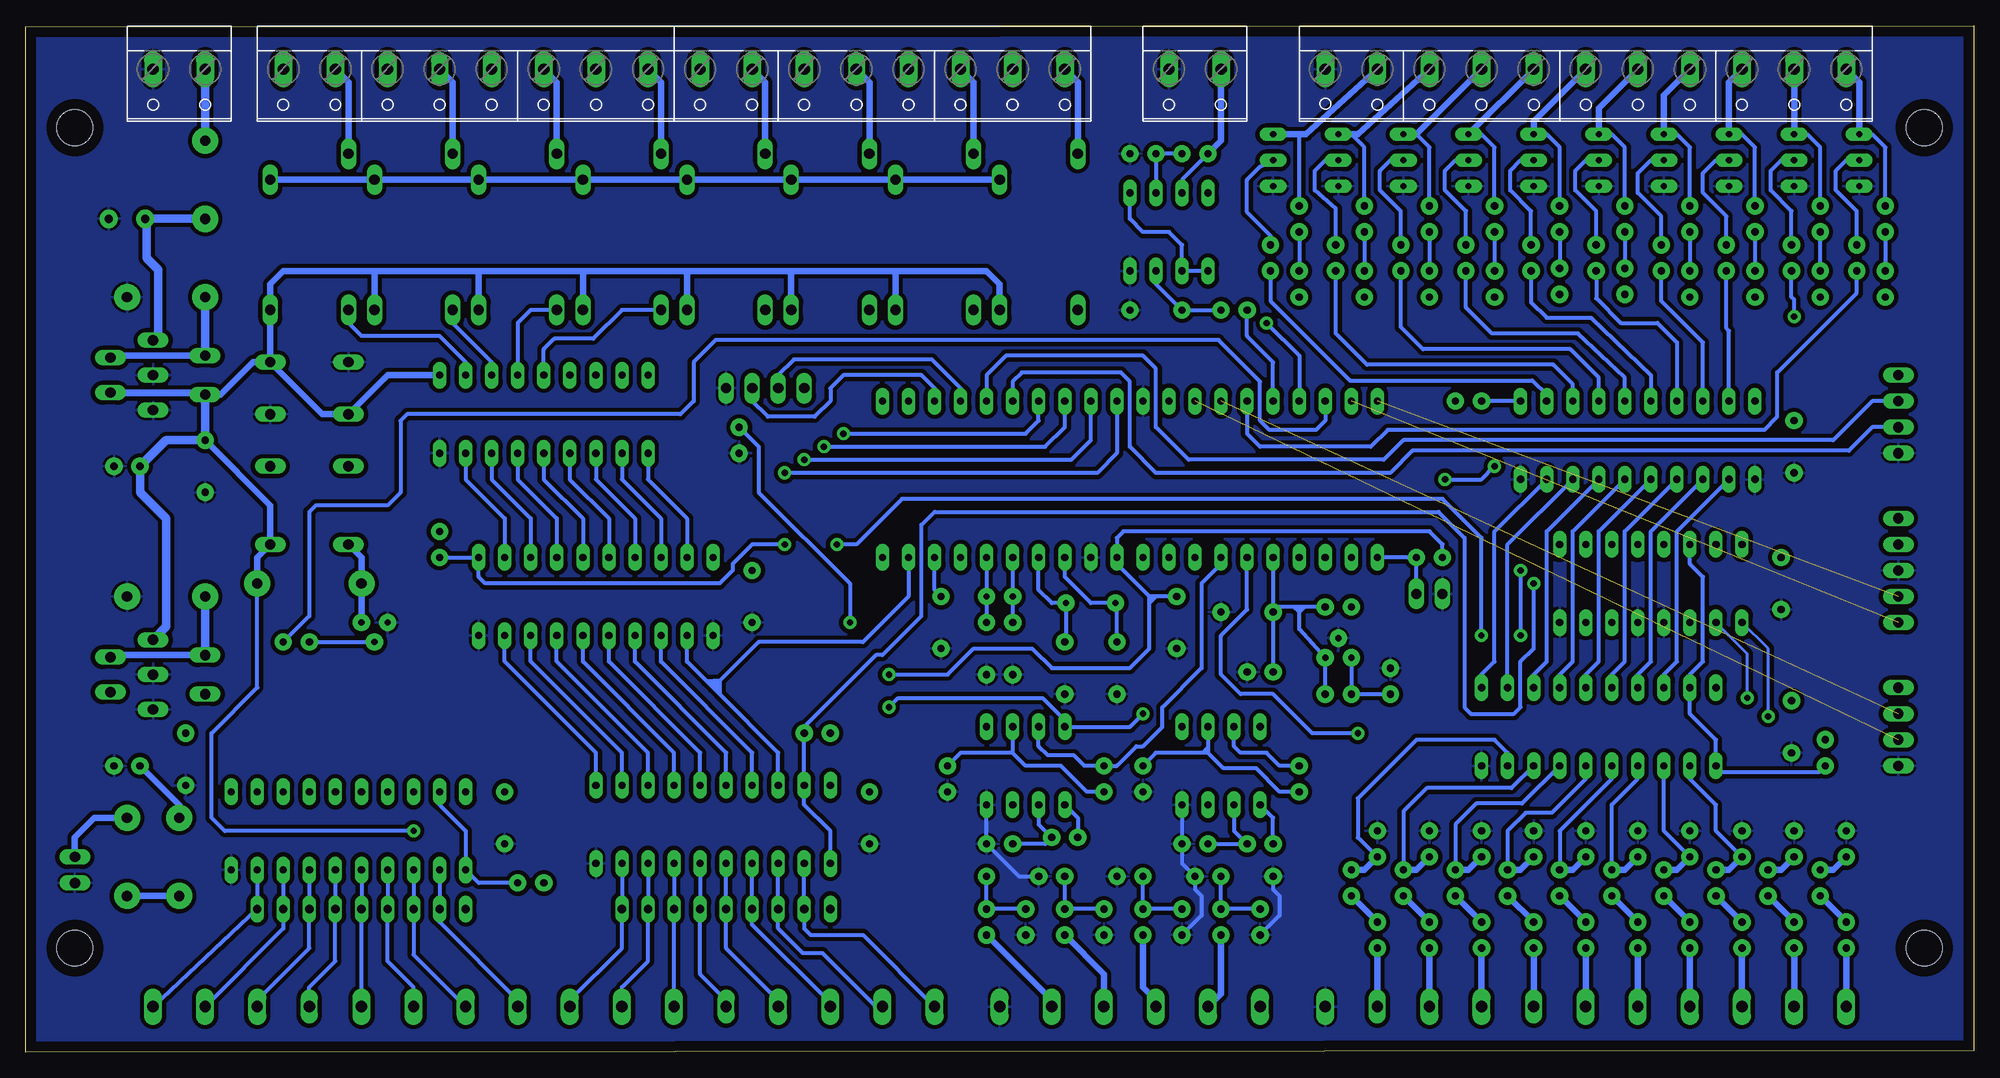
[diagram p4: board, bottom side, seen from below]

Size 189.97 x 100.13 mm. Coordinates in mm from the lower left corner, seen from the top.
Outline: 0,0.13 189.97,0 189.97,100 0,100.13 0,0.13
Copper layers (1*16): Top 0.035mm / dielectric 1.5mm / Bottom 0.035mm
Design rules "default *": minimum track width 12mil, minimum drill 24mil, track to track 16mil, track to pad 16mil, pad to pad 16mil, via to via 16mil, smd to smd 16mil, copper to edge 40mil, drill to drill 16mil, minimum pad ring 10mil, minimum via ring 8mil, stop-mask expansion 4mil, vias tented up to drill 0mil, thermal gap 10mil
Holes 3.5 mm at 4.83,10.16 4.83,90.17 185.17,90.17 185.17,10.16

### Footprints (pad centres in the part's own frame; a part is rotated, then mirrored left to right if it is on the bottom)
C050-024X044 = drill 0.7 pad 1.676: 1 -2.54,0; 2 2.54,0
E2,5-6 = drill 0.7 pad 1.676: + -1.27,0; - 1.27,0
E3,5-10 = drill 0.8 pad 1.778: + -1.778,0; - 1.778,0
E2,5-5 = drill 0.7 pad 1.676: + -1.27,0; - 1.27,0
W237-132 = drill 1.1 pad 1.778 long: 1 -2.54,-0.635; 2 2.54,-0.635
W237-11P = drill 1.1 pad 1.778 long: 1 -25.4,-0.635; 2 -20.32,-0.635; 3 -15.24,-0.635; 4 -10.16,-0.635; 5 -5.08,-0.635; 6 0,-0.635; 8 10.16,-0.635; 9 15.24,-0.635; 11 25.4,-0.635 | drill 1.1 long: 7 5.08,-0.635; 10 20.32,-0.635
W237-6P = drill 1.1 pad 1.778 long: 1 -12.7,-0.635; 2 -7.62,-0.635; 3 -2.54,-0.635; 4 2.54,-0.635; 5 7.62,-0.635; 6 12.7,-0.635
1X04 = drill 1 long: 1 -3.81,0; 2 -1.27,0; 3 1.27,0; 4 3.81,0
1X05 = drill 1 long: 1 -5.08,0; 2 -2.54,0; 3 0,0; 4 2.54,0; 5 5.08,0
1X02 = drill 1 long: 1 -1.27,0; 2 1.27,0
W237-8P = drill 1.1 pad 1.778 long: 1 -17.78,-0.635; 2 -12.7,-0.635; 3 -7.62,-0.635; 4 -2.54,-0.635; 6 7.62,-0.635; 7 12.7,-0.635; 8 17.78,-0.635 | drill 1.1 long: 5 2.54,-0.635
DO41-7.6 = drill 1 pad 2.54: A 3.81,0; C -3.81,0
DO41-10 = drill 1 pad 2.54: A 5.08,0; C -5.08,0
DIL40 = drill 0.7 pad 1.321 long: 1 -24.13,-7.62; 2 -21.59,-7.62; 3 -19.05,-7.62; 4 -16.51,-7.62; 5 -13.97,-7.62; 6 -11.43,-7.62; 7 -8.89,-7.62; 8 -6.35,-7.62; 9 -3.81,-7.62; 10 -1.27,-7.62; 11 1.27,-7.62; 12 3.81,-7.62; 13 6.35,-7.62; 14 8.89,-7.62; 15 11.43,-7.62; 16 13.97,-7.62; 17 16.51,-7.62; 18 19.05,-7.62; 19 21.59,-7.62; 20 24.13,-7.62; 21 24.13,7.62; 22 21.59,7.62; 23 19.05,7.62; 24 16.51,7.62; 25 13.97,7.62; 26 11.43,7.62; 27 8.89,7.62; 28 6.35,7.62; 29 3.81,7.62; 30 1.27,7.62; 31 -1.27,7.62; 32 -3.81,7.62; 33 -6.35,7.62; 34 -8.89,7.62; 35 -11.43,7.62; 36 -13.97,7.62; 37 -16.51,7.62; 38 -19.05,7.62; 39 -21.59,7.62; 40 -24.13,7.62
DIL08 = drill 0.7 pad 1.321 long: 1 -3.81,-3.81; 2 -1.27,-3.81; 3 1.27,-3.81; 4 3.81,-3.81; 5 3.81,3.81; 6 1.27,3.81; 7 -1.27,3.81; 8 -3.81,3.81
DIL20 = drill 0.7 pad 1.321 long: 1 -11.43,-3.81; 2 -8.89,-3.81; 3 -6.35,-3.81; 4 -3.81,-3.81; 5 -1.27,-3.81; 6 1.27,-3.81; 7 3.81,-3.81; 8 6.35,-3.81; 9 8.89,-3.81; 10 11.43,-3.81; 11 11.43,3.81; 12 8.89,3.81; 13 6.35,3.81; 14 3.81,3.81; 15 1.27,3.81; 16 -1.27,3.81; 17 -3.81,3.81; 18 -6.35,3.81; 19 -8.89,3.81; 20 -11.43,3.81
T05D = drill 1 pad 1.524 long: 1 -3.404,-5.08; 2 -1.702,-0.914; 3 0,-5.08; 4 1.702,-0.914; 5 3.404,-5.08
DIL16 = drill 0.7 pad 1.321 long: 1 -8.89,-3.81; 2 -6.35,-3.81; 3 -3.81,-3.81; 4 -1.27,-3.81; 5 1.27,-3.81; 6 3.81,-3.81; 7 6.35,-3.81; 8 8.89,-3.81; 9 8.89,3.81; 10 6.35,3.81; 11 3.81,3.81; 12 1.27,3.81; 13 -1.27,3.81; 14 -3.81,3.81; 15 -6.35,3.81; 16 -8.89,3.81
DIL18 = drill 0.7 pad 1.321 long: 1 -10.16,-3.81; 2 -7.62,-3.81; 3 -5.08,-3.81; 4 -2.54,-3.81; 5 0,-3.81; 6 2.54,-3.81; 7 5.08,-3.81; 8 7.62,-3.81; 9 10.16,-3.81; 10 10.16,3.81; 11 7.62,3.81; 12 5.08,3.81; 13 2.54,3.81; 14 0,3.81; 15 -2.54,3.81; 16 -5.08,3.81; 17 -7.62,3.81; 18 -10.16,3.81
351 = drill 1 long: 1 -3.81,-3.81; 16 -3.81,3.81; O1 8.89,-3.81; O2 8.89,3.81; P1 3.81,-3.81; P2 3.81,3.81; S1 13.97,-3.81; S2 13.97,3.81
JW1A = drill 1 long: 1 0.008,0; 4 12.713,0; 6 15.245,7.62; 8 0.008,7.62
82114R = drill 1 long: 1 0,1.905; 2 0,-1.905
LED3MM = drill 0.7 pad 1.676: A -1.27,0; K 1.27,0
0309V = drill 0.7 pad 1.676: 1 -1.27,0; 2 1.27,0
SIL9 = drill 0.8 long: 1 -10.16,0; 2 -7.62,0; 3 -5.08,0; 4 -2.54,0; 5 0,0; 6 2.54,0; 7 5.08,0; 8 7.62,0; 9 10.16,0
TO92-CBE = drill 0.6 pad 1.321 long: B 0,0; C -2.54,0; E 2.54,0
TO92 = drill 0.6 pad 1.676: 1 1.27,0; 2 0,1.905; 3 -1.27,0
TO92-CLP = drill 0.6 pad 1.676: A 0,1.905; C 1.27,0; R -1.27,0
HC49U-V = drill 0.6 pad 1.676: 1 -2.413,0; 2 2.413,0
TC26V = drill 0.6 pad 1.676: 1 -1.27,0; 2 1.27,0

### Placement (x,y rotation side)
C1  83.57,37.46 90 top
C2  88.65,37.46 90 top
C3  93.73,39.37 90 top
C4  96.27,39.37 90 top
C5  77.72,41.91 90 top
C7  69.6,37.08 0 top
C8  70.87,42.93 180 top
C9  180.09,81.28 0 top
C10  172.47,57.15 90 top
C11  79.76,72.39 180 top
C12  180.09,57.15 0 top
C13  93.73,17.14 0 top
C14  86.11,17.14 0 top
C15  78.49,17.14 0 top
C16  70.87,17.14 0 top
C17  100.71,41.91 90 top
C18  120.4,59.69 270 top
C19  174.37,28.57 90 top
C20  180.09,27.94 0 top
C21  18.8,45.72 90 top
C22  17.78,31.75 270 top
C23  17.53,59.05 270 top
C24  143.26,22.86 270 top
C25  107.7,22.86 90 top
C26  119.13,44.45 90 top
CN1  175.01,95.25 180 bottom
CN2  37.85,95.25 180 bottom
CN3  75.95,95.25 180 bottom
CN4  37.85,5.08 0 top
CN5  82.3,5.08 0 top
CN6  7.37,62.23 270 top
CN7  7.37,31.75 270 top
CN8  7.37,46.99 270 top
CN9  117.86,64.77 0 top
CN10  185.17,17.78 270 top
CN11  53.09,44.7 180 top
CN12  159.77,5.08 0 top
CN13  119.13,5.08 0 top
CN14  106.43,95.25 180 bottom
CN15  147.07,95.25 180 bottom
D1  176.28,44.45 0 top
D2  172.47,85.09 90 top
D3  162.31,45.72 180 top
D9  176.28,73.66 0 top
D10  180.09,19.05 90 top
D11  175.01,19.05 90 top
DRILEGEND  [DRILEGEND]  0,-3.81 0 top  (outside the outline)
IC1  82.3,55.88 0 top
IC2  92.46,27.94 0 top
IC3  36.58,31.75 0 top
IC4  78.49,80.01 0 top
IC5  73.41,27.94 0 top
IC6  182.63,66.04 270 top
IC7  31.5,45.72 0 top
IC8  32.77,59.69 0 top
IC11  158.5,21.59 0 top
IC12  122.94,22.22 0 top
IC13  139.45,62.23 0 top
IC14  134.37,44.45 0 top
IC15  182.63,36.83 270 top
K1  162.31,53.34 90 top
K2  95,72.39 90 top
K3  105.16,72.39 90 top
K4  115.32,72.39 90 top
K5  125.48,72.39 90 top
K6  135.64,72.39 90 top
K7  145.8,72.39 90 top
K8  155.96,72.39 90 top
K9  166.12,72.39 90 top
L1  172.47,66.04 0 top
L2  172.47,36.83 0 top
LD1  25.15,16.51 90 top
LD2  30.23,16.51 90 top
LD3  35.31,16.51 90 top
LD4  40.39,16.51 90 top
LD5  45.47,16.51 90 top
LD6  21.34,81.28 90 top
LD7  27.69,81.28 90 top
LD8  34.04,81.28 90 top
LD9  40.39,81.28 90 top
LD10  46.74,81.28 90 top
LD11  53.09,81.28 90 top
LD12  59.44,81.28 90 top
LD13  65.79,81.28 90 top
LD14  50.55,16.51 90 top
LD15  55.63,16.51 90 top
LD16  60.71,16.51 90 top
LD17  8.64,81.28 90 top
LD18  14.99,81.28 90 top
LD19  14.99,16.51 90 top
LD20  20.07,16.51 90 top
R1  53.09,48.26 180 top
R2  69.6,20.32 0 top
R3  75.95,20.32 0 top
R4  65.79,26.67 270 top
R5  81.03,26.67 270 top
R6  88.65,20.95 0 top
R7  95,20.32 0 top
R8  84.84,26.67 270 top
R9  100.08,26.67 270 top
R10  61.98,43.43 180 top
R11  61.98,34.92 180 top
R12  56.9,36.2 90 top
R13  22.61,11.43 270 top
R14  22.61,20.32 270 top
R15  27.69,11.43 270 top
R16  27.69,20.32 270 top
R17  32.77,11.43 270 top
R18  32.77,20.32 270 top
R19  37.85,11.43 270 top
R20  37.85,20.32 270 top
R21  42.93,11.43 270 top
R22  42.93,20.32 270 top
R23  24.13,77.47 90 top
R24  30.48,77.47 90 top
R25  36.83,77.47 90 top
R26  43.18,77.47 90 top
R27  49.53,77.47 90 top
R28  55.88,77.47 90 top
R29  62.23,77.47 90 top
R30  68.58,77.47 90 top
R31  48.01,11.43 270 top
R32  48.01,20.32 270 top
R33  53.09,11.43 270 top
R34  21.34,74.93 90 top
R35  27.69,74.93 90 top
R36  34.04,75.18 90 top
R37  40.39,75.18 90 top
R38  46.74,74.93 90 top
R39  53.09,74.93 90 top
R40  59.44,74.93 90 top
R41  65.79,74.93 90 top
R42  53.09,20.32 270 top
R43  58.17,11.43 270 top
R44  58.17,20.32 270 top
R45  72.14,72.39 180 top
R46  75.95,87.63 0 top
R47  81.03,87.63 0 top
R48  96.27,12.7 90 top
R49  92.46,12.7 90 top
R50  88.65,12.7 90 top
R51  84.84,12.7 90 top
R52  81.03,12.7 90 top
R53  77.22,12.7 90 top
R54  73.41,12.7 90 top
R55  69.6,12.7 90 top
R56  11.43,77.47 90 top
R57  17.78,77.47 90 top
R58  8.64,74.93 90 top
R59  14.99,74.93 90 top
R60  49.28,63.5 0 top
R88  163.58,40.01 0 top
R89  12.45,11.43 270 top
R90  12.45,20.32 270 top
R91  17.53,11.43 270 top
R92  17.53,20.32 270 top
R93  14.48,29.21 90 top
R95  140.72,16.51 180 top
R96  112.78,31.12 180 top
R97  149.61,49.53 270 top
RN1  121.67,13.97 0 top
RN2  157.23,13.97 0 top
T1  23.88,87 270 top
T2  30.23,87 270 top
T3  36.58,87 270 top
T4  42.93,87 270 top
T5  49.28,87 270 top
T6  55.63,87 270 top
T7  61.98,87 270 top
T8  68.33,87 270 top
T9  11.18,87 270 top
T10  17.53,87 270 top
T11  155.96,41.91 180 top
VR1  61.98,38.48 0 top
X1  86.11,43.81 180 top
X2  95,44.45 180 top

### Tracks (layer width: path | path; a pad name or v marks a point on that pad's centre or on a via)
+5V
  Top 0.406: IC3.20 25.15,38.1 26.42,39.37 26.42,43.43 26.92,43.94 34.54,43.94 35.31,43.18 IC7.6
  Bottom 0.61: D11.A 175.01,24.13 C20.+
  pour Top: 0.51,0.51 0.51,99.57 189.48,99.57 189.48,0.51
+12V  (via drill 0.6 pad 1.27)
  Top 0.406: K2.1 95,78.74 92.46,81.28 76.58,81.28 74.68,83.19 IC4.8 71.5,80.64 71.5,75.56 69.6,73.66 R41.1 R40.1 R39.1 R38.1 R37.1 R36.1 R35.1 R34.1 R59.1 R58.1 | v152.15,21.59 146.43,21.59 145.16,22.86 106.43,22.86 105.79,23.5 v105.79,33.66 | v81.03,33.02 79.5,34.54 71.5,34.54 69.6,32.64 IC5.8
  Bottom 0.406: 96.27,76.2 164.85,76.2 | 166.12,74.93 K1.S1 | L1.2 182.63,64.14 | v105.79,33.66 104.9,34.54 90.81,34.54 88.65,32.38 IC2.8 82.3,31.75 v81.03,33.02 | v152.15,21.59 170.56,21.59 171.83,22.86 171.83,31.12 167.39,35.56 D3.C
  Bottom 0.61: IC6.4 172.67,64.34 L1.2 170.94,64.14 167.77,67.31 K1.S1 | K2.1 95,74.93 96.27,76.2 105.16,76.2 | K3.1 105.16,76.2 | 105.16,76.2 115.32,76.2 | K4.1 115.32,76.2 | 115.32,76.2 125.48,76.2 | K5.1 125.48,76.2 | 125.48,76.2 135.64,76.2 | K6.1 135.64,76.2 | 135.64,76.2 145.8,76.2 | 155.96,76.2 164.85,76.2 166.12,74.93 K9.1 K1.S1 | 155.96,76.2 K8.1 | K7.1 145.8,76.2 | 145.8,76.2 155.96,76.2 | K1.S1 161.04,62.23 K1.O2 154.69,66.04 IC13.10 | D3.C 167.39,48.26 K1.1 166.12,53.34 C10.2
  Bottom 0.813: L1.2 C10.2 176.28,59.69 C12.+ 178.82,54.61 176.28,52.07 176.28,41.5 IC15.1
CS0  (via drill 0.6 pad 1.27)
  Top 0.305: IC1.8 75.95,50.8 75.44,51.31 59.94,51.31 59.44,50.8 59.44,46.74 57.4,44.7 57.4,40.89 52.58,36.07 52.58,33.02 50.55,30.99 21.84,30.99 v20.07,32.77
  Bottom 0.305: v20.07,32.77 20.07,39.37 IC7.1
CS1  (via drill 0.6 pad 1.27)
  Top 0.305: IC1.9 78.49,51.56 77.98,52.07 57.4,52.07 56.64,51.31 56.64,41.15 51.56,36.07 51.56,33.27 50.04,31.75 23.11,31.75 22.1,32.77 v22.1,34.54
  Bottom 0.305: v22.1,34.54 22.1,38.86 IC7.2
CS2
  Top 0.305: IC1.10 81.03,52.83 80.26,53.59 54.86,53.59 49.53,48.26 49.53,43.18 50.55,42.16 50.55,38.35 49.53,37.34 49.53,34.04 49.02,33.53 29.46,33.53 28.96,34.04 28.96,38.1 27.69,39.12 IC7.3
D0
  Top 0.406: IC11.18 152.15,27.94 151.51,28.57 133.73,28.57 125.48,36.83 IC14.2 | IC1.19 103.89,50.16 98.68,55.37 54.61,55.37 48.01,48.77 48.01,43.81 46.35,42.16 42.93,42.16 42.67,41.91 42.67,39.12 42.16,38.61 31.37,38.61 30.23,37.46 IC3.18
  Bottom 0.406: IC12.18 116.59,29.21 122.3,34.92 | 123.57,36.2 125.48,38.1 IC14.2 | IC3.18 30.23,36.83 28.96,38.1 28.96,50.8 IC8.2 | IC1.19 103.89,44.45 108.33,40.01 118.49,40.01 122.3,36.2 | 122.3,36.2 122.94,35.56 | 122.3,36.2 122.3,35.56 | 122.3,35.56 122.3,34.92 | 122.3,34.92 122.94,35.56 | 122.3,35.56 122.94,35.56 | 122.94,35.56 123.57,36.2 | 123.57,36.2 122.94,36.2 | 122.3,36.2 122.94,36.2 | 122.94,36.2 122.94,35.56
D1
  Top 0.406: IC11.17 154.69,28.57 153.42,29.84 135,29.84 128.02,36.83 IC14.3 128.02,42.55 126.75,43.81 112.4,43.81 108.08,48.13 106.55,48.13 IC1.20 106.43,51.94 101.47,56.9 54.48,56.9 46.99,49.4 46.99,44.58 45.59,43.18 42.16,43.18 41.66,42.67 41.66,40.13 41.15,39.62 37.21,39.62 36.58,40.26 36.58,43.81 35.31,45.09 29.59,45.09 28.96,45.72 28.96,50.8 26.42,53.34 IC8.3
  Bottom 0.406: IC12.17 119.13,29.21 128.02,38.1 IC14.3 | IC8.3 31.5,50.8 31.5,38.1 32.77,36.83 IC3.17
D2
  Top 0.406: IC11.16 157.23,29.21 155.32,31.12 136.27,31.12 130.56,36.83 IC14.4 130.56,43.81 129.29,45.09 112.65,45.09 108.59,49.15 108.59,51.18 106.43,53.34 106.43,57.15 | 106.43,57.15 106.43,57.78 | IC1.21 106.43,58.42 | 106.43,57.78 105.79,57.78 | 105.79,57.78 50.55,57.78 49.91,57.15 49.91,55.88 46.1,52.07 32.13,52.07 28.96,55.24 IC8.4 | 105.79,57.78 106.43,58.42 | 106.43,58.42 106.43,57.78 | 106.43,57.15 105.79,57.78
  Bottom 0.406: IC3.16 35.31,36.83 34.04,38.1 34.04,50.8 IC8.4 | IC12.16 121.67,29.21 130.56,38.1 IC14.4
D3
  Top 0.406: IC11.15 159.77,29.21 155.96,33.02 136.91,33.02 133.1,36.83 IC14.5 133.1,44.45 131.83,45.72 131.83,49.53 130.56,50.8 110.24,50.8 108.33,52.7 108.33,65.15 107.7,65.79 104.52,65.79 103.89,65.15 IC1.22 103.89,60.2 102.62,58.93 49.91,58.93 48.64,57.66 48.64,56.52 45.47,53.34 32.77,53.34 31.5,54.61 IC8.5
  Bottom 0.406: IC3.15 37.85,36.83 36.58,38.1 36.58,50.8 IC8.5 | IC12.15 124.21,29.21 133.1,38.1 IC14.5
D4  (via drill 0.6, 0.6 pad 1.27)
  Top 0.406: IC11.14 162.31,29.21 157.23,34.29 138.18,34.29 135.64,36.83 IC14.6 135.64,44.45 134.37,45.72 134.37,50.16 132.46,52.07 112.14,52.07 110.24,53.98 v110.24,60.33 | IC1.27 91.19,64.77 86.11,69.85 36.58,69.85 35.31,68.58 35.31,57.15 IC8.6
  Bottom 0.406: IC3.14 40.39,36.83 39.12,38.1 39.12,50.8 IC8.6 | IC12.14 126.75,29.21 135.64,38.1 IC14.6 | v110.24,60.33 92.46,60.33 91.19,61.59 IC1.27
  other vias: 135.64,40.64
D5  (via drill 0.6, 0.6 pad 1.27)
  Top 0.406: IC11.13 164.85,29.21 158.5,35.56 139.45,35.56 138.18,36.83 IC14.7 138.18,44.45 136.91,45.72 136.91,50.16 133.73,53.34 113.41,53.34 112.14,54.61 v112.14,59.05 | IC1.28 88.65,64.14 84.2,68.58 39.12,68.58 37.85,67.31 37.85,57.15 IC8.7
  Bottom 0.406: IC3.13 42.93,36.83 41.66,38.1 41.66,50.8 IC8.7 | IC12.13 129.29,29.21 138.18,38.1 IC14.7 | v112.14,59.05 90.55,59.05 88.65,60.96 IC1.28
  other vias: 138.18,40.64
D6  (via drill 0.6, 0.6 pad 1.27)
  Top 0.406: IC11.12 167.39,29.21 159.77,36.83 141.99,36.83 140.72,38.1 IC14.8 140.72,44.45 139.45,45.72 139.45,50.8 135.64,54.61 114.68,54.61 114.05,55.24 v114.05,57.78 | IC1.29 86.11,64.77 83.57,67.31 41.66,67.31 40.39,66.04 40.39,57.15 IC8.8
  Bottom 0.406: IC8.8 45.47,49.53 IC3.12 | IC12.12 131.83,29.21 140.72,38.1 IC14.8 | v114.05,57.78 88.01,57.78 86.11,59.69 IC1.29
  other vias: 140.72,40.64
D7  (via drill 0.6 pad 1.27)
  Top 0.406: IC11.11 169.93,29.21 161.04,38.1 143.89,38.1 143.26,38.73 IC14.9 143.26,44.45 141.99,45.72 141.99,51.44 137.54,55.88 116.59,55.88 v115.95,56.52 | IC1.30 83.57,65.41 82.68,66.29 44.45,66.29 42.93,64.77 42.93,57.15 IC8.9
  Bottom 0.406: IC3.11 48.01,36.83 46.74,38.1 46.74,50.8 IC8.9 | IC12.11 134.37,29.21 143.26,38.1 IC14.9 | IC1.30 83.57,58.42 85.47,56.52 v115.95,56.52
ED0
  Bottom 0.406: R14.2 25.15,21.59 25.15,24.13 27.69,26.67 IC3.2
  Bottom 0.61: LD1.K 23.88,17.78 R14.2
ED1
  Bottom 0.406: R16.2 30.23,21.59 IC3.3
  Bottom 0.61: LD2.K 28.96,17.78 R16.2
ED2
  Bottom 0.406: IC3.4 32.77,26.67 35.31,24.13 LD3.K
  Bottom 0.61: LD3.K 34.04,17.78 R18.2
ED3
  Bottom 0.406: IC3.5 35.31,26.67 40.39,21.59 LD4.K
  Bottom 0.61: LD4.K 39.12,17.78 R20.2
ED4
  Bottom 0.406: IC3.6 37.85,26.67 41.15,23.37 43.69,23.37 45.47,21.59 LD5.K
  Bottom 0.61: LD5.K 44.2,17.78 R22.2
ED5
  Bottom 0.406: IC3.7 44.07,24.26 48.51,24.26 50.55,22.22 LD14.K
  Bottom 0.61: LD14.K 49.28,17.78 R32.2
ED6
  Bottom 0.406: IC3.8 45.08,25.78 53.34,25.78 55.63,23.5 LD15.K
  Bottom 0.61: LD15.K 54.36,17.78 R42.2
ED7
  Bottom 0.406: R44.2 60.07,20.95 60.07,24.77 54.36,30.48 46.74,30.48 45.47,29.21 IC3.9
  Bottom 0.61: LD16.K 59.44,17.78 R44.2
EN1
  Bottom 0.406: R93.1 15.11,27.3 24.51,27.3 IC3.1 25.15,30.48 27.69,33.02 IC3.19 27.69,36.83 26.42,38.1 26.42,46.35 27.69,47.62 IC7.14
EN2  (via drill 0.6 pad 1.27)
  Top 0.406: IC7.13 30.23,47.62 31.5,46.35 35.94,46.35 37.85,44.45 44.83,44.45 45.97,45.59 45.97,50.29 v51.56,55.88 | v46.74,57.15 46.74,62.23 R60.1
  Bottom 0.406: IC8.11 R60.1 | v51.56,55.88 48.01,55.88 v46.74,57.15
EN3
  Top 0.406: R95.1 141.99,12.7 140.08,10.79 101.35,10.79 98.17,7.62 11.18,7.62 9.27,9.52 9.27,24.77 11.18,26.67 11.18,38.1 10.54,38.73 5.46,38.73 4.19,40.01 4.19,53.34 6.1,55.24 11.18,55.24 14.35,58.42 27.05,58.42 27.69,57.78 27.69,54.61 IC7.12
  Bottom 0.406: IC11.19 149.61,24.13 147.07,21.59 IC11.1 145.8,16.51 R95.1
EN4  (via drill 0.6 pad 1.27)
  Top 0.406: v42.93,45.72 38.48,45.72 35.31,48.89 IC7.11
  Bottom 0.406: IC12.1 111.51,21.59 114.05,24.13 IC12.19 R96.1 114.05,31.75 107.06,38.73 106.43,38.73 102.62,42.55 102.62,51.44 101.35,52.7 52.2,52.7 49.66,50.16 49.66,33.66 49.02,33.02 44.83,33.02 44.2,33.66 44.2,38.1 42.93,39.37 v42.93,45.72
EN5  (via drill 0.6 pad 1.27)
  Top 0.406: IC7.10 37.85,48.26 39.12,46.99 v44.2,46.99 | v44.2,40.64 v48.01,40.64 | v110.87,49.53 v115.95,49.53
  Bottom 0.406: R97.2 IC14.11 145.8,46.35 145.16,45.72 122.3,45.72 121.03,46.99 121.03,47.62 119.13,49.53 v115.95,49.53 | v44.2,46.99 v44.2,40.64 | v48.01,40.64 48.01,50.16 51.82,53.98 104.52,53.98 108.97,49.53 v110.87,49.53
GND
  Bottom 0.406: IC5.4 R3.2 77.22,18.41 C15.1 75.95,15.88 75.31,15.24 75.31,13.33 R53.1 | C16.1 68.33,15.88 67.69,15.24 67.69,13.33 R55.1 | IC2.4 R7.2 93.09,17.14 C13.1
  pour Bottom: 0.51,0.51 0.51,99.57 189.48,99.57 189.48,0.51
IN0  (via drill 0.6 pad 1.27)
  Top 0.406: LD19.K 14.99,24.13 16.26,25.4 49.91,25.4 52.45,27.94 56.9,27.94 v60.07,31.12
  Bottom 0.406: v60.07,31.12 64.52,31.12 68.33,34.92 71.5,34.92 73.41,36.83 73.41,40.64 70.87,43.18 IC1.6
  Bottom 0.61: LD19.K 13.72,17.78 R90.2
IN1
  Top 0.406: LD20.K 20.07,22.86 20.7,23.5 60.71,23.5 63.88,20.32 63.88,10.16 64.9,9.14 97.16,9.14 103.89,15.88 103.89,29.84 98.81,34.92 IC1.17
  Bottom 0.61: LD20.K 18.8,17.78 R92.2
N$1
  Bottom 0.406: C1.2 83.57,43.05 X1.2 86.11,43.81 88.65,46.35 IC1.13
N$2
  Bottom 0.406: IC1.14 91.19,45.09 89.92,43.81 X1.1 88.52,39.5
  Bottom 0.61: 88.52,39.5 C2.2
N$3
  Bottom 0.406: R56.2 11.43,82.04 13.46,84.07 13.46,85.98 12.45,87 T9.B
N$4
  Bottom 0.406: IC1.15 X2.2 C3.2
N$5
  Bottom 0.406: IC1.16 X2.1 C4.2
N$6
  Bottom 0.406: R57.2 17.78,82.04 19.81,84.07 19.81,85.98 18.8,87 T10.B
N$7
  Top 0.406: CN8.1 11.18,52.07 12.45,50.8 12.45,40.64 16.26,36.83 21.97,36.83 23.5,35.31 23.5,33.66 24.26,32.64 49.53,32.64 50.55,33.66 50.55,36.2 54.36,40.01 CN11.1
  Bottom 0.406: IC1.1 R1.1 CN11.1
N$8
  Bottom 0.406: IC5.2 72.14,21.59 R2.2 R3.1
N$9
  Top 0.406: IC5.1 69.6,27.69 66.29,30.99 66.29,44.96 64.52,46.74 64.52,50.04 64.01,50.55 61.21,50.55 60.71,50.04 IC1.2
  Bottom 0.406: R2.1 68.33,22.86 IC5.1
N$10
  Top 0.406: IC1.3 63.25,46.35 65.28,44.32 65.28,28.45 R4.1
  Bottom 0.406: R4.1 67.69,27.94 68.96,29.21 71.5,29.21 72.14,29.84 IC5.7
N$11
  Bottom 0.406: R4.2 67.69,25.4 69.98,27.69 73.15,27.69 74.68,29.21 | IC5.6 74.68,29.72 | 74.68,29.72 74.68,29.21 | 74.68,29.21 75.18,29.21 | 75.18,29.21 79.76,29.21 R5.1 | 75.18,29.21 74.68,29.72
N$12
  Bottom 0.61: CN5.2 73.41,5.71 R54.1
N$13
  Bottom 0.406: IC2.2 91.19,22.22 R6.2 90.55,20.32 R7.1
N$14
  Bottom 0.406: R8.2 86.49,25.4 89.03,27.94 92.46,27.94 93.73,29.21 | IC2.6 93.73,29.21 | 93.73,29.21 98.81,29.21 R9.1
N$15
  Bottom 0.406: IC2.7 91.19,29.84 90.3,28.96 87.76,28.96 86.74,27.94 R8.1 83.57,27.94 81.66,29.84 81.03,29.84 79.12,31.75 79.12,33.66 75.31,37.46 75.31,45.72 73.41,47.62 IC1.7
N$16
  Bottom 0.61: CN5.3 79.76,5.08 81.03,6.35 R52.1
N$17
  Bottom 0.61: CN5.4 84.84,7.62 R50.1
N$18
  Bottom 0.61: CN5.5 89.92,5.08 R48.1
N$19
  Bottom 0.406: IC11.2 RN2.2 149.61,12.7 141.99,5.08
  Bottom 0.61: 141.99,5.08 CN12.1 141.99,3.81
N$20
  Bottom 0.406: R29.2 62.23,82.3 64.26,84.07 64.26,85.98 63.25,87 T7.B
N$21
  Bottom 0.406: IC1.5 C8.2 | C8.2 C7.+ | R10.1 65.28,43.43 | 65.28,43.43 65.53,43.43 | 65.53,43.43 65.79,43.43 | R11.1 VR1.C 65.79,41.27 65.79,42.93 | 65.79,42.93 65.79,43.18 | 65.79,43.18 65.79,43.43 | 65.79,43.43 66.29,43.43 | 66.29,43.43 67.82,43.43 C8.2 | 65.79,43.18 65.53,43.43 | 65.79,42.93 66.29,43.43 | 65.79,42.93 65.28,43.43
N$22
  Bottom 0.406: VR1.R R11.2 R12.1
N$23
  Top 0.406: IC2.1 86.74,24.13 86.11,23.5 83.57,23.5 82.93,24.13 82.93,33.02 79.76,36.2 76.58,36.2 75.31,37.46 75.31,44.83 74.68,45.47 67.06,45.47 65.79,46.74 IC1.4
  Bottom 0.406: IC2.1 87.38,22.86 R6.1
N$24
  Bottom 0.61: R13.1 LD1.A
N$25
  Bottom 0.813: D2.A CN1.1
N$26
  Top 0.406: IC13.18 124.21,66.04 122.68,67.56 109.86,67.56 108.84,68.58 95,68.58 91.19,72.39 K2.8
N$27
  Bottom 0.406: R30.2 68.58,79.63 70.87,81.92 70.87,85.09 69.6,86.36 T8.B
N$28
  Top 0.406: C13.2 96.27,17.78 98.17,19.68 98.17,29.84 IC2.5
  Bottom 0.406: R49.2 R48.2 C13.2
N$29
  Top 0.406: IC5.5 77.22,27.94 79.12,26.04 79.12,24.77 81.03,22.86 C15.2
  Bottom 0.406: R53.2 R52.2 C15.2
N$30
  Bottom 0.406: LD17.K 8.64,88.27 9.91,89.53 T9.C
  Bottom 0.61: T9.C 11.18,94.61 CN2.1
N$31
  Bottom 0.61: R15.1 LD2.A
N$32
  Bottom 0.406: R23.2 24.13,81.53 26.42,83.82 26.42,85.72 25.15,87 T1.B
N$33
  Bottom 0.61: R17.1 LD3.A
N$34
  Bottom 0.406: R24.2 30.48,81.53 32.77,83.82 32.77,85.72 31.5,87 T2.B
N$35
  Bottom 0.61: R19.1 LD4.A
N$36
  Bottom 0.61: R21.1 LD5.A
N$37
  Bottom 0.406: R25.2 36.83,82.04 38.86,84.07 38.86,85.98 37.85,87 T3.B
N$38
  Bottom 0.61: CN4.1 R89.2
N$39
  Bottom 0.406: R26.2 43.18,82.04 45.21,84.07 45.21,85.98 44.2,87 T4.B
N$40
  Bottom 0.406: R27.2 49.53,82.04 51.56,84.07 51.56,85.98 50.55,87 T5.B
N$41
  Bottom 0.406: R28.2 55.88,82.04 57.91,84.07 57.91,85.98 56.9,87 T6.B
N$42
  Bottom 0.61: CN4.2 R91.2
N$43
  Bottom 0.61: CN4.3 R13.2
N$44
  Bottom 0.61: CN4.4 R15.2
N$45
  Bottom 0.61: CN4.5 R17.2
N$46
  Bottom 0.406: LD6.K 21.34,88.27 22.61,89.53 T1.C
  Bottom 0.61: T1.C 23.88,94.61 CN2.3
N$47
  Bottom 0.406: LD7.K 27.69,88.27 28.96,89.53 T2.C
  Bottom 0.61: T2.C 30.23,93.34 CN2.4
N$48
  Bottom 0.406: LD6.A R34.2
N$49
  Bottom 0.406: LD7.A R35.2
N$50
  Bottom 0.406: LD8.K 34.04,88.27 35.31,89.53 T3.C
  Bottom 0.61: T3.C 36.58,92.08 CN2.5
N$51
  Bottom 0.406: LD8.A R36.2
N$52
  Bottom 0.406: LD9.K 40.39,88.27 41.66,89.53 T4.C
  Bottom 0.61: T4.C 42.93,90.8 CN2.6
N$53
  Bottom 0.406: LD9.A R37.2
N$54
  Bottom 0.406: LD10.K 46.74,88.27 48.01,89.53 T5.C
  Bottom 0.61: T5.C CN2.7
N$55
  Bottom 0.406: LD11.K 53.09,88.27 54.36,89.53
  Bottom 0.61: T6.C 54.36,89.53 CN2.8
N$56
  Bottom 0.406: LD10.A R38.2
N$57
  Bottom 0.406: LD11.A R39.2
N$58
  Bottom 0.406: LD12.K 59.44,88.27 60.71,89.53
  Bottom 0.61: T7.C 60.71,89.53 60.07,89.53 CN2.9
N$59
  Bottom 0.406: LD12.A R40.2
N$60
  Bottom 0.406: LD13.K 65.79,89.53
  Bottom 0.61: T8.C 65.79,89.53 65.15,89.53 CN2.10
N$61
  Bottom 0.406: LD13.A R41.2
N$62
  Bottom 0.406: LD18.K 14.99,88.27 16.26,89.53 T10.C
  Bottom 0.61: T10.C CN2.2
N$63
  Bottom 0.406: IC11.3 RN2.3 152.15,9.52 CN12.2
N$64
  Bottom 0.406: LD17.A R58.2
N$65
  Bottom 0.406: R59.2 LD18.A
N$66  (1 unrouted)
N$67
  Bottom 0.61: R31.1 LD14.A
N$68  (1 unrouted)
N$69
  Bottom 0.406: IC4.1 IC4.2 77.22,78.74 78.49,80.01 81.03,80.01 82.3,81.28 IC4.5
N$70
  Bottom 0.61: CN4.6 R19.2
N$71
  Bottom 0.406: IC4.3 79.76,74.93 C11.2 R45.1
N$72
  Bottom 0.406: IC1.36 68.33,67.31 70.87,69.85 R45.2
N$73
  Bottom 0.406: R46.2 R47.1 IC4.6
N$74
  Bottom 0.406: R46.1 77.22,85.09 IC4.7
  Bottom 0.61: CN3.1 73.41,88.9 R46.1
N$75
  Bottom 0.406: IC1.24 98.81,64.77 101.6,67.56 115.06,67.56 116.59,66.04 CN9.2
N$76
  Bottom 0.61: CN4.7 R21.2
N$77
  Bottom 0.406: IC1.23 101.35,64.77 102.62,66.04 110.24,66.04 111.51,64.77 111.51,63.5 113.03,61.98 117.6,61.98 119.13,63.5 CN9.3
N$78
  Bottom 0.61: CN4.8 R31.2
N$79  (via drill 0.6 pad 1.27)
  Top 0.305: IC1.32 78.49,61.47 78.99,60.96 101.85,60.96 102.62,61.72 102.62,66.29 102.87,66.55 108.71,66.55 114.3,60.96 C18.+
  Top 0.406: v109.6,41.91 109.6,40.64 v105.79,36.83
  Top 0.61: C18.+ 121.67,62.23 149.61,62.23 157.86,53.98 169.29,53.98 169.93,53.34 169.93,31.75 172.47,29.21 172.47,20.95 175.01,18.41 D11.C
  Bottom 0.406: C5.2 79.76,44.45 | 79.76,44.45 80.39,44.45 | C18.+ 118.49,59.05 118.49,54.61 109.6,45.72 v109.6,41.91 | v105.79,36.83 100.08,36.83 97.54,39.37 91.82,39.37 89.92,37.46 82.3,37.46 80.39,39.37 80.39,44.45 | 80.39,44.45 83.57,47.62 IC1.11 83.57,50.16 82.93,50.8 53.09,50.8 51.82,49.53 R1.2 | 80.26,43.94 79.76,44.45
  Bottom 0.61: D11.C D10.C
N$80
  Bottom 0.406: C17.2 101.35,45.09 IC1.18
N$81
  Bottom 0.61: R33.1 LD15.A
N$82
  Bottom 0.61: CN4.9 R33.2
N$83
  Bottom 0.61: CN4.10 R43.2
N$84  (1 unrouted)
N$85
  Bottom 0.61: R43.1 LD16.A
N$86  (1 unrouted)
N$89
  Bottom 0.61: CN10.1 185.17,20.95 183.26,22.86 D10.A
N$90
  Bottom 0.61: L1.1 181.51,67.94 IC6.2
  Bottom 0.813: D9.C L1.1
N$97
  Bottom 0.406: R26.1 43.18,73.15 41.66,71.63 37.34,71.63 31.5,66.04 IC8.16
N$98
  Bottom 0.406: IC8.15 34.04,65.79 38.61,70.1 46.99,70.1 49.53,72.64 R27.1
N$99
  Bottom 0.406: R25.1 36.83,73.53 34.42,71.12 30.86,71.12 28.96,69.22 IC8.17
N$100
  Bottom 0.406: IC8.18 26.42,69.22 30.48,73.28 R24.1
N$101
  Bottom 0.406: IC8.19 23.88,70.36 24.13,70.61 R23.1
N$102
  Bottom 0.406: IC8.14 36.58,65.79 39.37,68.58 53.72,68.58 55.88,70.74 R28.1
N$103
  Bottom 0.406: IC8.13 39.12,65.15 41.02,67.06 59.18,67.06 62.23,70.1 R29.1
N$104
  Bottom 0.406: R30.1 68.58,73.28 60.83,65.53 43.05,65.53 41.66,64.14 IC8.12
N$137
  Top 0.406: IC5.3 74.68,22.86 72.77,20.95 72.77,17.78 C16.2
  Bottom 0.406: R55.2 R54.2 C16.2
N$138
  Top 0.406: IC2.3 93.73,22.86 91.82,20.95 91.82,19.68 91.19,19.05 90.55,19.05 C14.2
  Bottom 0.406: R51.2 R50.2 C14.2
N$139
  Bottom 0.406: IC11.4 RN2.4 154.69,8.89 152.15,6.35 CN12.3
N$140
  Bottom 0.406: IC11.5 RN2.5 CN12.4
N$141
  Bottom 0.406: IC11.6 RN2.6 159.77,8.89 162.31,6.35 CN12.5
N$142
  Bottom 0.406: IC11.7 RN2.7 162.31,10.16 167.39,5.08
  Bottom 0.61: CN12.6 167.39,5.08
N$143
  Bottom 0.406: IC11.8 RN2.8 164.85,12.06 CN12.7
N$144
  Bottom 0.406: IC11.9 RN2.9 CN12.8
N$145
  Bottom 0.406: IC12.2 RN1.2 114.05,12.06 113.41,11.43 108.33,11.43 CN13.1
N$146
  Bottom 0.406: IC12.3 RN1.3 116.59,12.06 114.17,9.65 112.27,9.65 107.06,4.45
  Bottom 0.61: CN13.2 107.06,4.45
N$147
  Bottom 0.406: IC12.4 RN1.4 119.13,12.45 111.51,4.83
  Bottom 0.61: CN13.3 111.51,4.83
N$148
  Bottom 0.406: IC12.5 RN1.5 121.67,10.16 116.59,5.08
  Bottom 0.61: CN13.4 116.59,5.08
N$149
  Bottom 0.406: IC12.6 RN1.6 124.21,7.62 121.67,5.08
  Bottom 0.61: CN13.5 121.67,5.08
N$150
  Bottom 0.406: IC12.7 RN1.7 CN13.6
N$151
  Bottom 0.406: IC12.8 RN1.8 129.29,8.89 131.83,6.35 CN13.7
N$152
  Bottom 0.406: IC12.9 RN1.9 131.83,10.16 136.91,5.08
  Bottom 0.61: CN13.8 136.91,5.08
N$153
  Bottom 0.61: L2.1 181.51,38.73 IC15.2
  Bottom 0.813: D1.C L2.1
N$155
  Top 0.61: K1.P2 157.86,57.15 153.42,61.59 153.42,82.56 K8.4
  Bottom 0.61: K2.4 K3.4 K4.4 K5.4 K6.4 K7.4 K8.4 K9.4
N$156
  Top 0.406: IC13.17 131.83,67.31 130.3,68.83 109.98,68.83 108.97,69.85 98.17,69.85 97.54,70.48 K3.8
N$157
  Bottom 0.61: K2.6 87.38,94.61 CN14.1
N$158
  Bottom 0.61: K3.6 97.54,94.61 CN14.3
N$159
  Bottom 0.61: K4.6 107.7,94.61 CN14.5
N$160
  Bottom 0.61: K5.6 117.86,94.61 CN14.7
N$161
  Bottom 0.61: K6.6 128.02,94.61 CN15.1
N$162
  Bottom 0.61: K7.6 138.18,94.61 CN15.3
N$163
  Bottom 0.61: K8.6 148.34,94.61 CN15.5
N$164
  Bottom 0.61: K9.6 158.5,94.61 CN15.7
N$165
  Top 0.406: IC13.16 134.37,67.31 131.83,69.85 110.24,69.85 K4.8
N$166
  Top 0.406: IC13.15 136.91,67.31 129.03,75.18 120.64,75.18 K5.8
N$167
  Bottom 0.406: IC13.14 139.45,68.58 138.43,69.6 134.62,69.6 131.82,72.4 K6.8
N$168
  Bottom 0.406: K7.8 140.71,72.4 141.99,71.12 IC13.13
N$169
  Bottom 0.406: K8.8 148.34,71.12 144.53,67.31 IC13.12
N$170
  Bottom 0.406: K9.8 158.5,71.12 157.23,69.85 149.61,69.85 147.07,67.31 IC13.11
N$171
  Bottom 0.406: R88.1 T11.2
N$172
  Bottom 0.406: IC13.1 129.29,55.88 125.48,52.07 IC14.19
N$173
  Top 0.61: K1.P1 167.39,57.15 169.29,59.05 169.29,91.44 CN15.8 164.85,95.25 162.31,92.71 154.69,92.71 | CN15.6 154.69,92.71 | 154.69,92.71 144.53,92.71 | CN15.4 144.53,92.71 | 144.53,92.71 134.37,92.71 | CN15.2 134.37,92.71 | 134.37,92.71 124.21,92.71 | CN14.8 124.21,92.71 | 124.21,92.71 114.05,92.71 | CN14.6 114.05,92.71 | 114.05,92.71 103.89,92.71 | CN14.4 103.89,92.71 | 103.89,92.71 95,92.71 93.73,93.98 CN14.2
N$174
  Bottom 0.406: IC13.2 131.83,55.88 128.02,52.07 IC14.18
N$175
  Bottom 0.406: IC13.3 134.37,55.88 130.56,52.07 IC14.17
N$176
  Bottom 0.406: IC13.4 136.91,55.88 133.1,52.07 IC14.16
N$177
  Bottom 0.406: IC13.5 139.45,55.88 135.64,52.07 IC14.15
N$178
  Bottom 0.406: IC13.6 141.99,55.88 138.18,52.07 IC14.14
N$179
  Bottom 0.406: IC13.7 144.53,55.88 140.72,52.07 IC14.13
N$180
  Bottom 0.406: IC13.8 147.07,55.88 143.26,52.07 IC14.12
N$181
  Bottom 0.61: K1.16 157.23,48.26 D3.A T11.3
N$183
  Bottom 0.61: R89.1 LD19.A
N$184
  Bottom 0.61: R91.1 LD20.A
OUT0
  Bottom 0.406: IC1.35 70.87,60.33 69.6,59.05 58.8,59.05 57.15,60.71 20.45,60.71 19.18,61.98 19.18,66.29 11.43,74.04 R56.1
OUT1  (via drill 0.6 pad 1.27)
  Top 0.406: v17.53,71.75 68.33,71.75 v68.96,71.12
  Bottom 0.406: v68.96,71.12 65.79,67.94 IC1.37 | v17.53,71.75 17.53,73.41 17.78,73.66 R57.1
RELE
  Bottom 0.406: IC1.38 63.25,61.59 64.14,60.71 68.71,60.71 69.6,61.59 69.6,65.41 73.66,69.47 122.68,69.47 124.84,67.31 124.84,63.5 126.11,62.23 152.78,62.23 153.42,61.59 153.42,54.61 154.69,53.34 161.67,53.34 162.31,52.7 162.31,42.55 R88.2
RX
  Bottom 0.406: CN6.3 9.91,60.96 12.19,58.67 54.74,58.67 56.9,56.52 79.76,56.52 82.3,59.05 82.3,65.41 83.19,66.29 92.84,66.29 93.73,65.41 IC1.26
TX
  Bottom 0.406: CN6.2 9.91,63.5 13.72,59.69 55.63,59.69 57.53,57.78 76.58,57.78 79.76,60.96 79.76,66.67 81.03,67.94 94.36,67.94 96.27,66.04 IC1.25
V+
  Bottom 0.61: 177.04,69.95 IC6.1 | 178.18,81.15 C9.+
  Bottom 0.813: D2.C C9.+ | 177.04,69.95 177.04,76.33 178.18,77.47 178.18,81.15

### Text on the board
tPlace: USB | DISPLAY | PROG | RESET | EXPANSAO | EL00117 | www.easylogix.com.br
tDocu: RESET
DrillLegend: LAYER-STACK
DrillLegend_01-16: 01-16
DrillLegend_01-20: 01-20